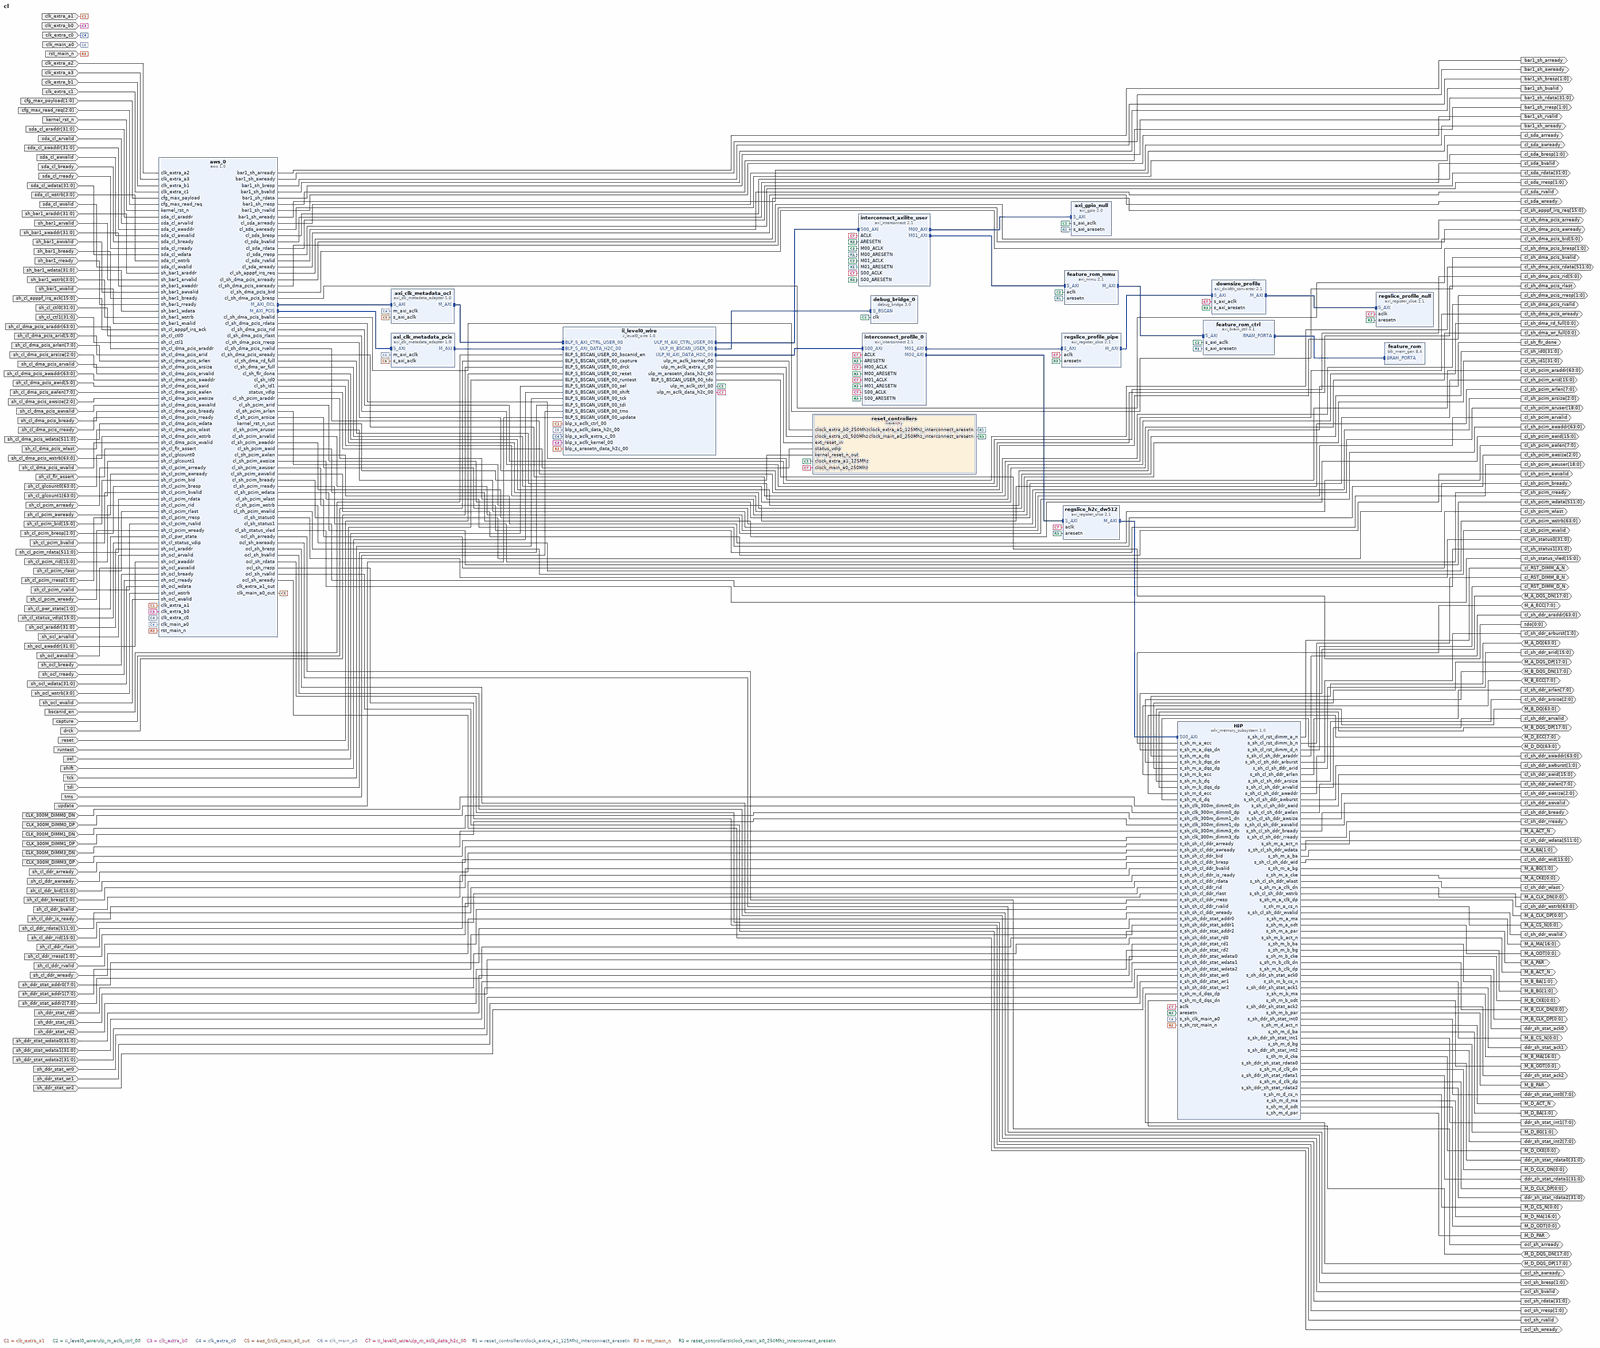
[diagram p0: block diagram of the top level, whole]
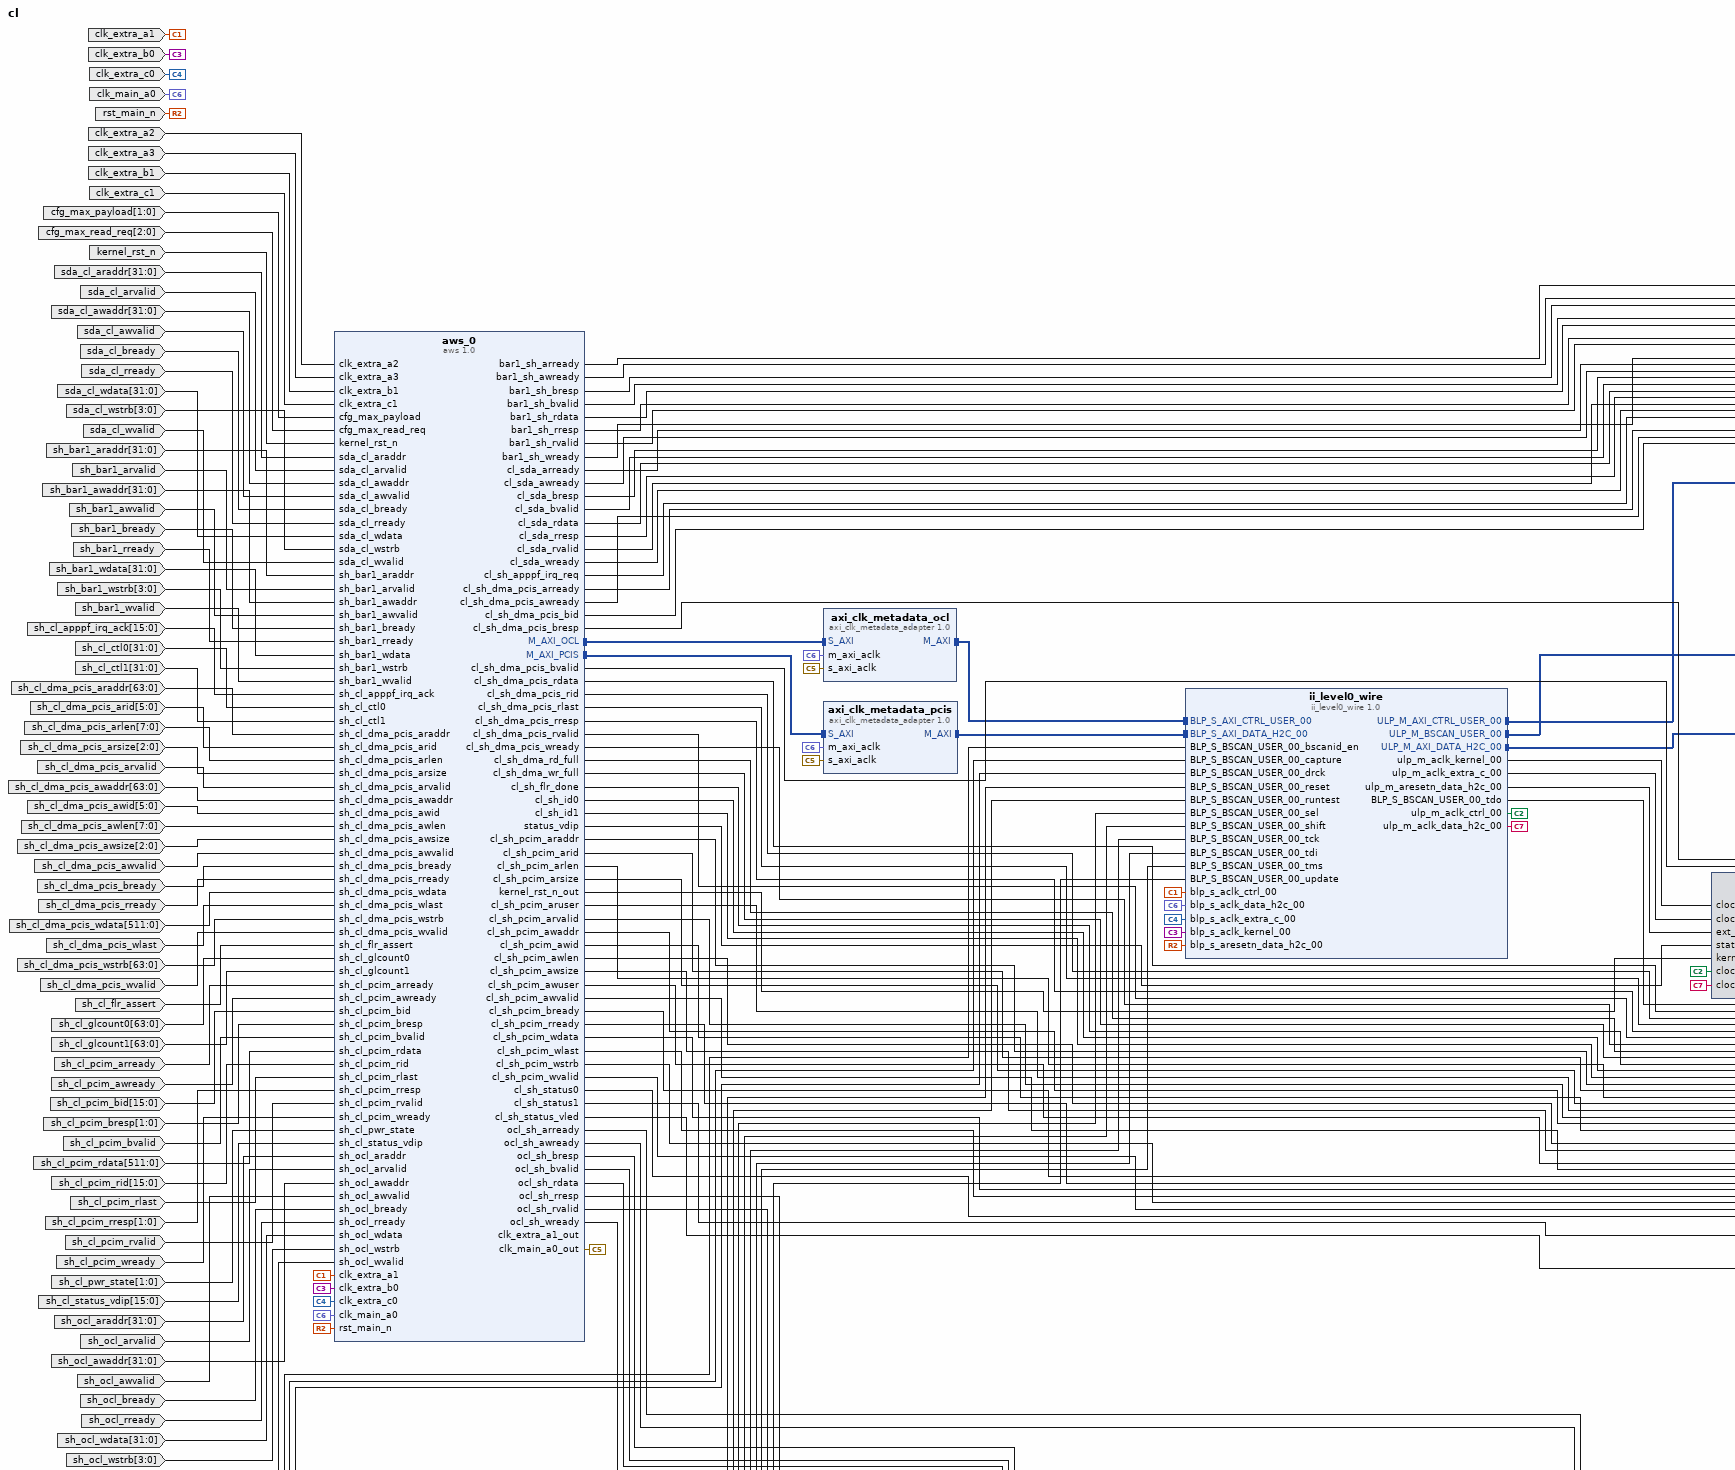
[diagram p1: block diagram of the top level, upper left part]
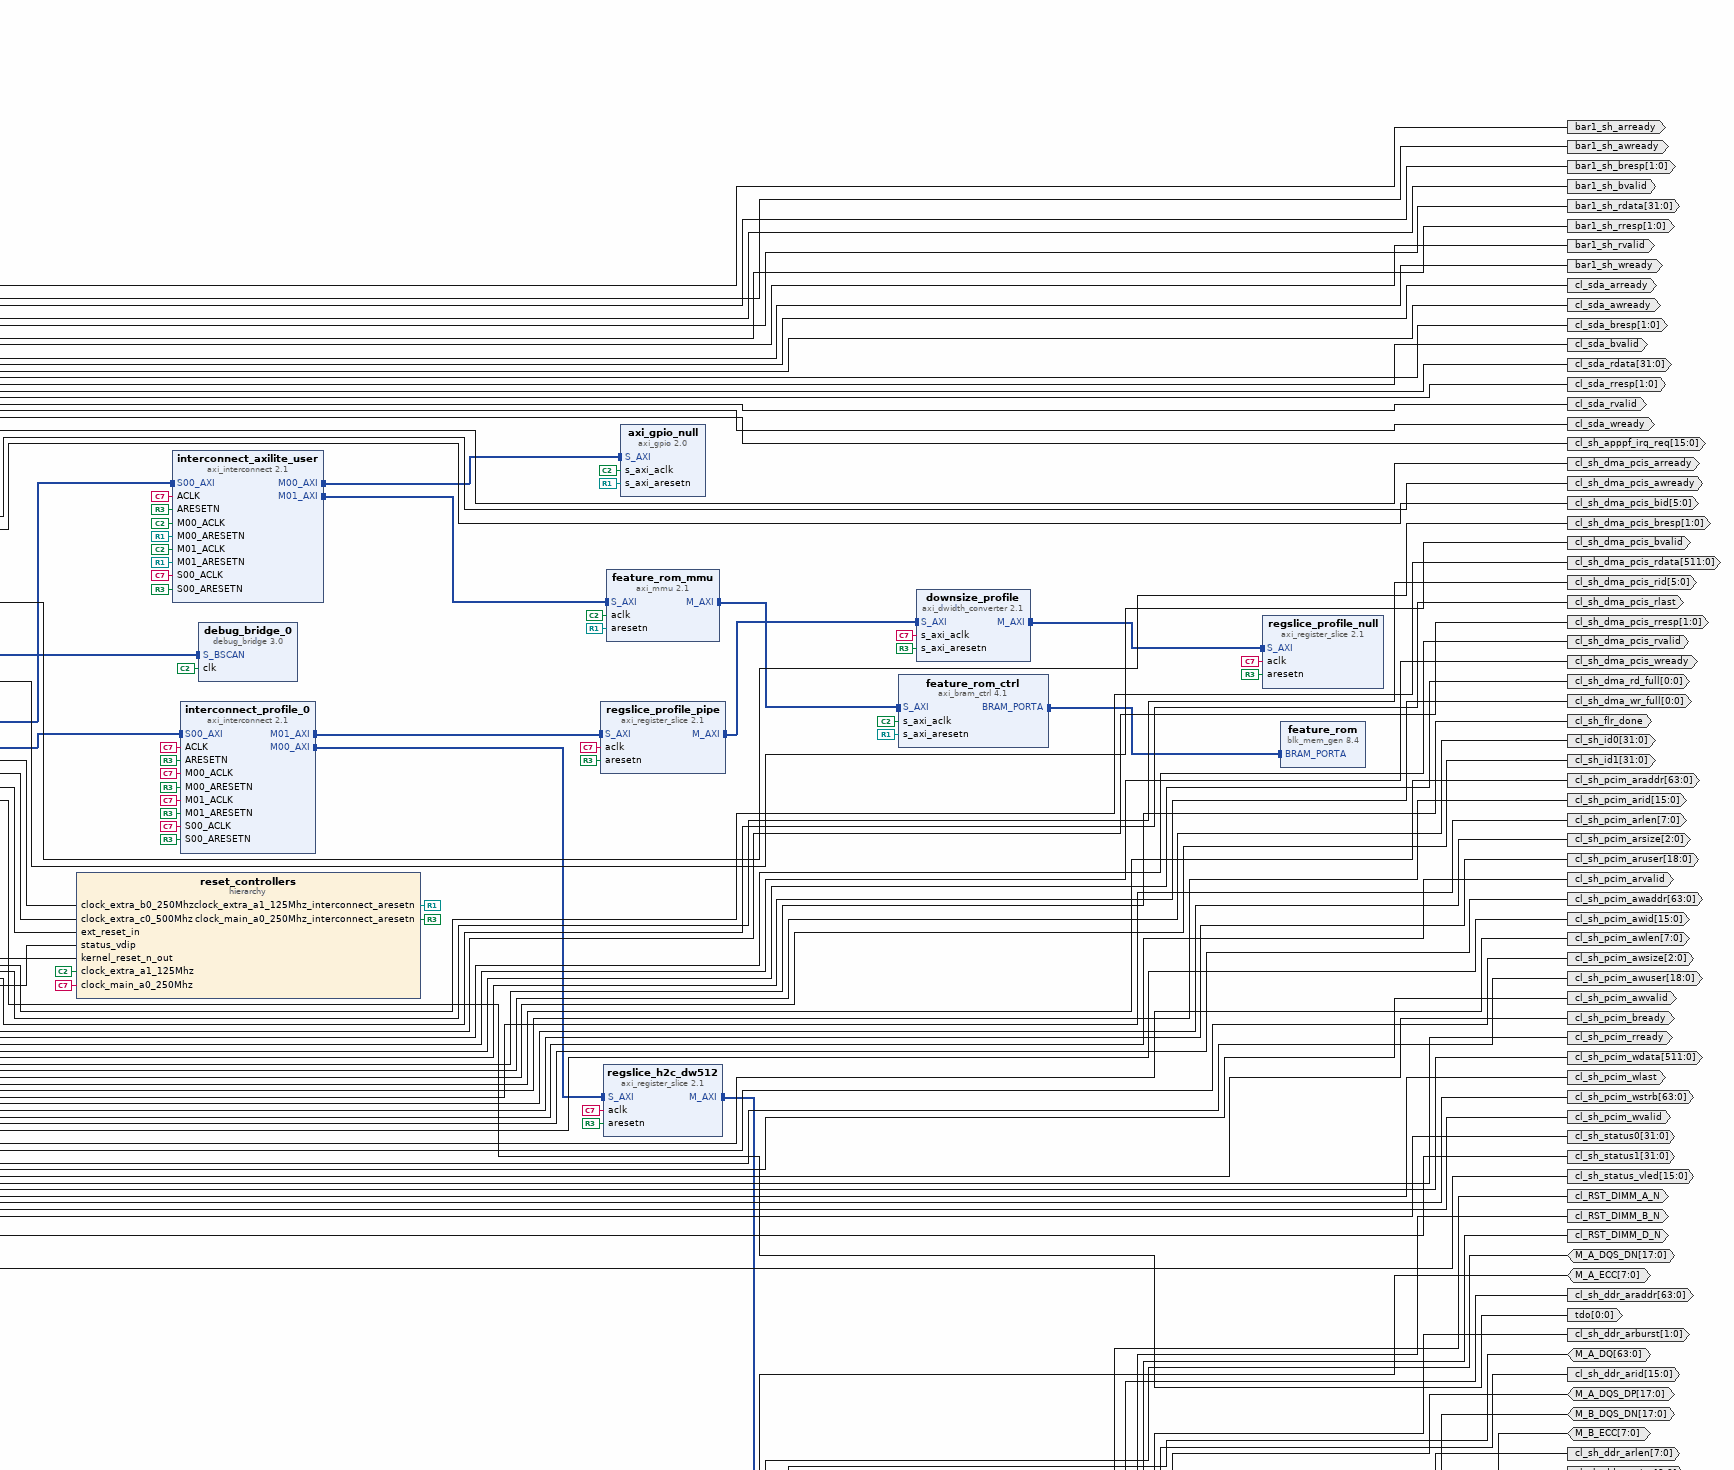
[diagram p2: block diagram of the top level, upper right part]
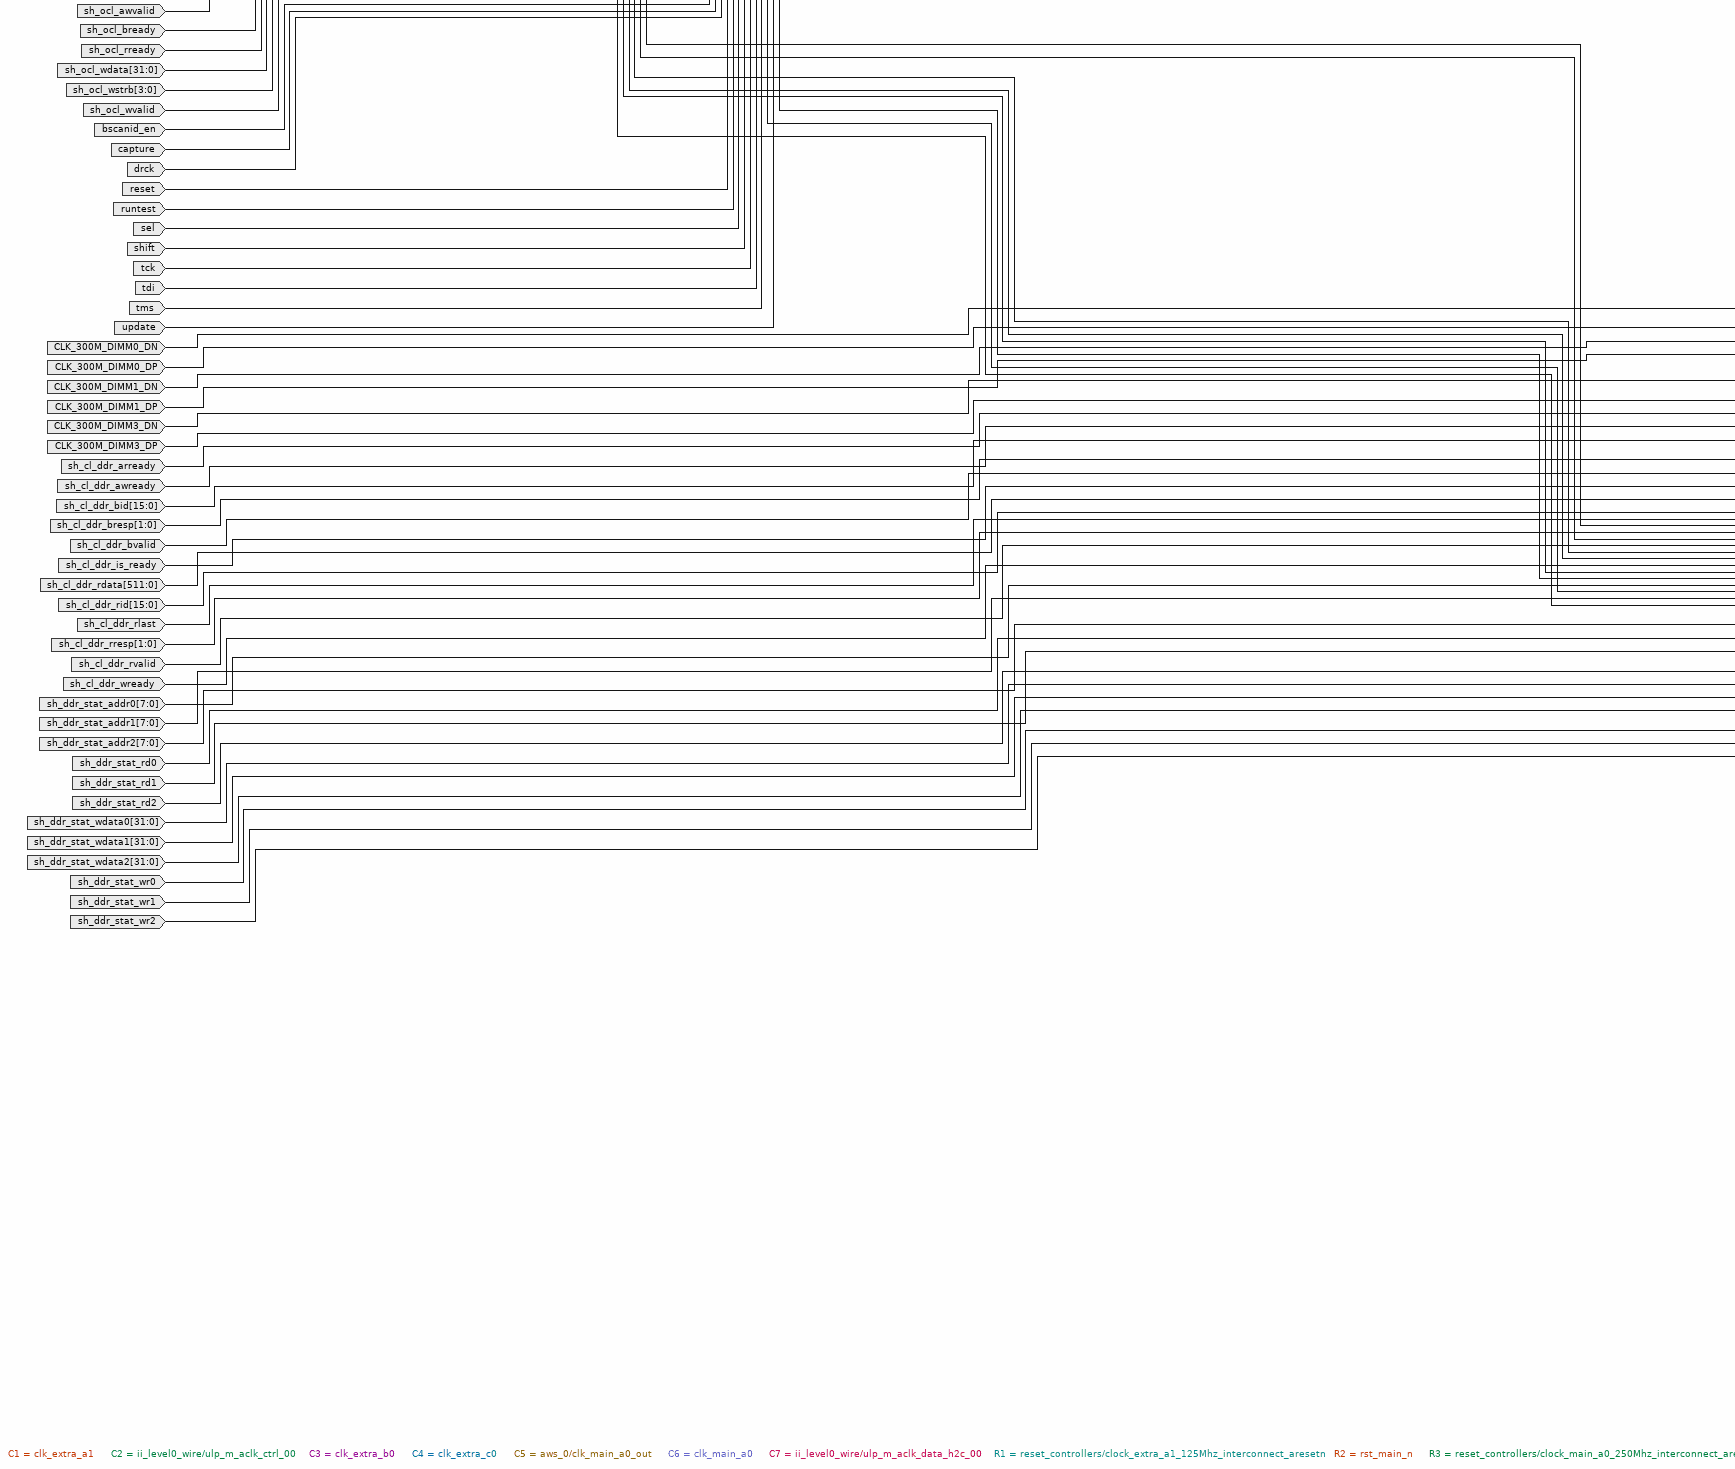
[diagram p3: block diagram of the top level, lower left part]
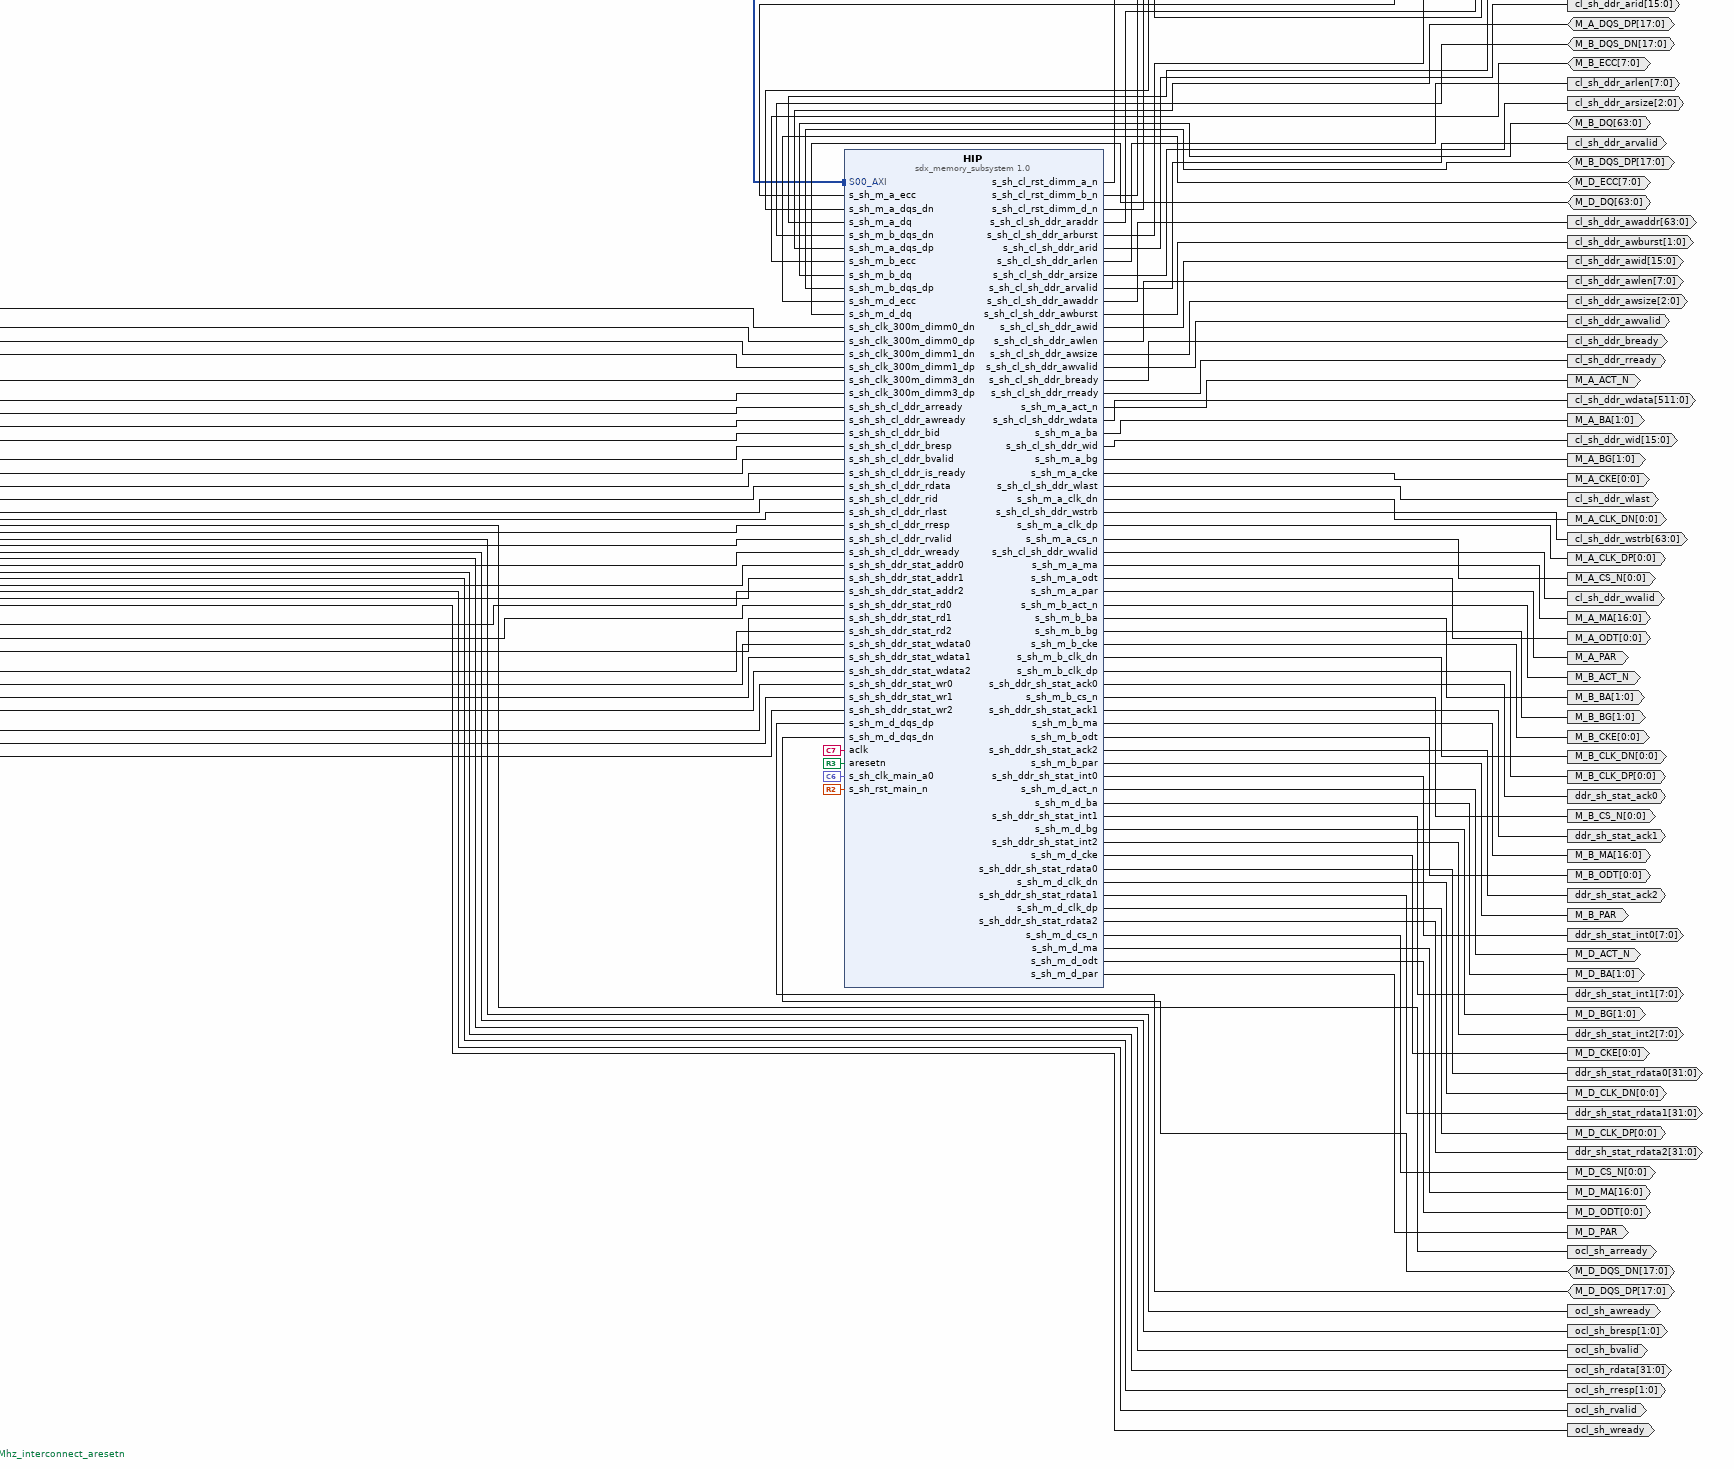
[diagram p4: block diagram of the top level, lower right part]
# Vivado block design cl, xcvu9p-flgb2104-2-i, Vivado 2019.2
create_bd_design cl

create_bd_port -dir I CLK_300M_DIMM0_DN
create_bd_port -dir I CLK_300M_DIMM0_DP
create_bd_port -dir I CLK_300M_DIMM1_DN
create_bd_port -dir I CLK_300M_DIMM1_DP
create_bd_port -dir I CLK_300M_DIMM3_DN
create_bd_port -dir I CLK_300M_DIMM3_DP
create_bd_port -dir O M_A_ACT_N
create_bd_port -dir O -from 1 -to 0 M_A_BA
create_bd_port -dir O -from 1 -to 0 M_A_BG
create_bd_port -dir O -from 0 -to 0 M_A_CKE
create_bd_port -dir O -from 0 -to 0 M_A_CLK_DN
create_bd_port -dir O -from 0 -to 0 M_A_CLK_DP
create_bd_port -dir O -from 0 -to 0 M_A_CS_N
create_bd_port -dir IO -from 63 -to 0 M_A_DQ
create_bd_port -dir IO -from 17 -to 0 M_A_DQS_DN
create_bd_port -dir IO -from 17 -to 0 M_A_DQS_DP
create_bd_port -dir IO -from 7 -to 0 M_A_ECC
create_bd_port -dir O -from 16 -to 0 M_A_MA
create_bd_port -dir O -from 0 -to 0 M_A_ODT
create_bd_port -dir O M_A_PAR
create_bd_port -dir O M_B_ACT_N
create_bd_port -dir O -from 1 -to 0 M_B_BA
create_bd_port -dir O -from 1 -to 0 M_B_BG
create_bd_port -dir O -from 0 -to 0 M_B_CKE
create_bd_port -dir O -from 0 -to 0 M_B_CLK_DN
create_bd_port -dir O -from 0 -to 0 M_B_CLK_DP
create_bd_port -dir O -from 0 -to 0 M_B_CS_N
create_bd_port -dir IO -from 63 -to 0 M_B_DQ
create_bd_port -dir IO -from 17 -to 0 M_B_DQS_DN
create_bd_port -dir IO -from 17 -to 0 M_B_DQS_DP
create_bd_port -dir IO -from 7 -to 0 M_B_ECC
create_bd_port -dir O -from 16 -to 0 M_B_MA
create_bd_port -dir O -from 0 -to 0 M_B_ODT
create_bd_port -dir O M_B_PAR
create_bd_port -dir O M_D_ACT_N
create_bd_port -dir O -from 1 -to 0 M_D_BA
create_bd_port -dir O -from 1 -to 0 M_D_BG
create_bd_port -dir O -from 0 -to 0 M_D_CKE
create_bd_port -dir O -from 0 -to 0 M_D_CLK_DN
create_bd_port -dir O -from 0 -to 0 M_D_CLK_DP
create_bd_port -dir O -from 0 -to 0 M_D_CS_N
create_bd_port -dir IO -from 63 -to 0 M_D_DQ
create_bd_port -dir IO -from 17 -to 0 M_D_DQS_DN
create_bd_port -dir IO -from 17 -to 0 M_D_DQS_DP
create_bd_port -dir IO -from 7 -to 0 M_D_ECC
create_bd_port -dir O -from 16 -to 0 M_D_MA
create_bd_port -dir O -from 0 -to 0 M_D_ODT
create_bd_port -dir O M_D_PAR
create_bd_port -dir O bar1_sh_arready
create_bd_port -dir O bar1_sh_awready
create_bd_port -dir O -from 1 -to 0 bar1_sh_bresp
create_bd_port -dir O bar1_sh_bvalid
create_bd_port -dir O -from 31 -to 0 bar1_sh_rdata
create_bd_port -dir O -from 1 -to 0 bar1_sh_rresp
create_bd_port -dir O bar1_sh_rvalid
create_bd_port -dir O bar1_sh_wready
create_bd_port -dir I bscanid_en
create_bd_port -dir I capture
create_bd_port -dir I -from 1 -to 0 cfg_max_payload
create_bd_port -dir I -from 2 -to 0 cfg_max_read_req
create_bd_port -dir O cl_RST_DIMM_A_N
create_bd_port -dir O cl_RST_DIMM_B_N
create_bd_port -dir O cl_RST_DIMM_D_N
create_bd_port -dir O cl_sda_arready
create_bd_port -dir O cl_sda_awready
create_bd_port -dir O -from 1 -to 0 cl_sda_bresp
create_bd_port -dir O cl_sda_bvalid
create_bd_port -dir O -from 31 -to 0 cl_sda_rdata
create_bd_port -dir O -from 1 -to 0 cl_sda_rresp
create_bd_port -dir O cl_sda_rvalid
create_bd_port -dir O cl_sda_wready
create_bd_port -dir O -from 15 -to 0 cl_sh_apppf_irq_req
create_bd_port -dir O -from 63 -to 0 cl_sh_ddr_araddr
create_bd_port -dir O -from 1 -to 0 cl_sh_ddr_arburst
create_bd_port -dir O -from 15 -to 0 cl_sh_ddr_arid
create_bd_port -dir O -from 7 -to 0 cl_sh_ddr_arlen
create_bd_port -dir O -from 2 -to 0 cl_sh_ddr_arsize
create_bd_port -dir O cl_sh_ddr_arvalid
create_bd_port -dir O -from 63 -to 0 cl_sh_ddr_awaddr
create_bd_port -dir O -from 1 -to 0 cl_sh_ddr_awburst
create_bd_port -dir O -from 15 -to 0 cl_sh_ddr_awid
create_bd_port -dir O -from 7 -to 0 cl_sh_ddr_awlen
create_bd_port -dir O -from 2 -to 0 cl_sh_ddr_awsize
create_bd_port -dir O cl_sh_ddr_awvalid
create_bd_port -dir O cl_sh_ddr_bready
create_bd_port -dir O cl_sh_ddr_rready
create_bd_port -dir O -from 511 -to 0 cl_sh_ddr_wdata
create_bd_port -dir O -from 15 -to 0 cl_sh_ddr_wid
create_bd_port -dir O cl_sh_ddr_wlast
create_bd_port -dir O -from 63 -to 0 cl_sh_ddr_wstrb
create_bd_port -dir O cl_sh_ddr_wvalid
create_bd_port -dir O cl_sh_dma_pcis_arready
create_bd_port -dir O cl_sh_dma_pcis_awready
create_bd_port -dir O -from 5 -to 0 cl_sh_dma_pcis_bid
create_bd_port -dir O -from 1 -to 0 cl_sh_dma_pcis_bresp
create_bd_port -dir O cl_sh_dma_pcis_bvalid
create_bd_port -dir O -from 511 -to 0 cl_sh_dma_pcis_rdata
create_bd_port -dir O -from 5 -to 0 cl_sh_dma_pcis_rid
create_bd_port -dir O cl_sh_dma_pcis_rlast
create_bd_port -dir O -from 1 -to 0 cl_sh_dma_pcis_rresp
create_bd_port -dir O cl_sh_dma_pcis_rvalid
create_bd_port -dir O cl_sh_dma_pcis_wready
create_bd_port -dir O -from 0 -to 0 cl_sh_dma_rd_full
create_bd_port -dir O -from 0 -to 0 cl_sh_dma_wr_full
create_bd_port -dir O cl_sh_flr_done
create_bd_port -dir O -from 31 -to 0 cl_sh_id0
create_bd_port -dir O -from 31 -to 0 cl_sh_id1
create_bd_port -dir O -from 63 -to 0 cl_sh_pcim_araddr
create_bd_port -dir O -from 15 -to 0 cl_sh_pcim_arid
create_bd_port -dir O -from 7 -to 0 cl_sh_pcim_arlen
create_bd_port -dir O -from 2 -to 0 cl_sh_pcim_arsize
create_bd_port -dir O -from 18 -to 0 cl_sh_pcim_aruser
create_bd_port -dir O cl_sh_pcim_arvalid
create_bd_port -dir O -from 63 -to 0 cl_sh_pcim_awaddr
create_bd_port -dir O -from 15 -to 0 cl_sh_pcim_awid
create_bd_port -dir O -from 7 -to 0 cl_sh_pcim_awlen
create_bd_port -dir O -from 2 -to 0 cl_sh_pcim_awsize
create_bd_port -dir O -from 18 -to 0 cl_sh_pcim_awuser
create_bd_port -dir O cl_sh_pcim_awvalid
create_bd_port -dir O cl_sh_pcim_bready
create_bd_port -dir O cl_sh_pcim_rready
create_bd_port -dir O -from 511 -to 0 cl_sh_pcim_wdata
create_bd_port -dir O cl_sh_pcim_wlast
create_bd_port -dir O -from 63 -to 0 cl_sh_pcim_wstrb
create_bd_port -dir O cl_sh_pcim_wvalid
create_bd_port -dir O -from 31 -to 0 cl_sh_status0
create_bd_port -dir O -from 31 -to 0 cl_sh_status1
create_bd_port -dir O -from 15 -to 0 cl_sh_status_vled
create_bd_port -dir I -type clk clk_extra_a1
set_property -dict {CONFIG.CLK_DOMAIN cd_ctrl_00 CONFIG.FREQ_HZ 125000000} [get_bd_ports clk_extra_a1]
create_bd_port -dir I clk_extra_a2
create_bd_port -dir I clk_extra_a3
create_bd_port -dir I -type clk clk_extra_b0
set_property -dict {CONFIG.CLK_DOMAIN cd_extra_b_00 CONFIG.FREQ_HZ 250000000} [get_bd_ports clk_extra_b0]
create_bd_port -dir I clk_extra_b1
create_bd_port -dir I -type clk clk_extra_c0
set_property -dict {CONFIG.CLK_DOMAIN cd_extra_c_00 CONFIG.FREQ_HZ 500000000} [get_bd_ports clk_extra_c0]
create_bd_port -dir I clk_extra_c1
create_bd_port -dir I -type clk clk_main_a0
set_property -dict {CONFIG.CLK_DOMAIN cd_data_h2c_00 CONFIG.FREQ_HZ 250000000} [get_bd_ports clk_main_a0]
create_bd_port -dir O ddr_sh_stat_ack0
create_bd_port -dir O ddr_sh_stat_ack1
create_bd_port -dir O ddr_sh_stat_ack2
create_bd_port -dir O -from 7 -to 0 ddr_sh_stat_int0
create_bd_port -dir O -from 7 -to 0 ddr_sh_stat_int1
create_bd_port -dir O -from 7 -to 0 ddr_sh_stat_int2
create_bd_port -dir O -from 31 -to 0 ddr_sh_stat_rdata0
create_bd_port -dir O -from 31 -to 0 ddr_sh_stat_rdata1
create_bd_port -dir O -from 31 -to 0 ddr_sh_stat_rdata2
create_bd_port -dir I -type clk drck
create_bd_port -dir I kernel_rst_n
create_bd_port -dir O ocl_sh_arready
create_bd_port -dir O ocl_sh_awready
create_bd_port -dir O -from 1 -to 0 ocl_sh_bresp
create_bd_port -dir O ocl_sh_bvalid
create_bd_port -dir O -from 31 -to 0 ocl_sh_rdata
create_bd_port -dir O -from 1 -to 0 ocl_sh_rresp
create_bd_port -dir O ocl_sh_rvalid
create_bd_port -dir O ocl_sh_wready
create_bd_port -dir I -type rst reset
create_bd_port -dir I rst_main_n
create_bd_port -dir I runtest
create_bd_port -dir I -from 31 -to 0 sda_cl_araddr
create_bd_port -dir I sda_cl_arvalid
create_bd_port -dir I -from 31 -to 0 sda_cl_awaddr
create_bd_port -dir I sda_cl_awvalid
create_bd_port -dir I sda_cl_bready
create_bd_port -dir I sda_cl_rready
create_bd_port -dir I -from 31 -to 0 sda_cl_wdata
create_bd_port -dir I -from 3 -to 0 sda_cl_wstrb
create_bd_port -dir I sda_cl_wvalid
create_bd_port -dir I sel
create_bd_port -dir I -from 31 -to 0 sh_bar1_araddr
create_bd_port -dir I sh_bar1_arvalid
create_bd_port -dir I -from 31 -to 0 sh_bar1_awaddr
create_bd_port -dir I sh_bar1_awvalid
create_bd_port -dir I sh_bar1_bready
create_bd_port -dir I sh_bar1_rready
create_bd_port -dir I -from 31 -to 0 sh_bar1_wdata
create_bd_port -dir I -from 3 -to 0 sh_bar1_wstrb
create_bd_port -dir I sh_bar1_wvalid
create_bd_port -dir I -from 15 -to 0 sh_cl_apppf_irq_ack
create_bd_port -dir I -from 31 -to 0 sh_cl_ctl0
create_bd_port -dir I -from 31 -to 0 sh_cl_ctl1
create_bd_port -dir I sh_cl_ddr_arready
create_bd_port -dir I sh_cl_ddr_awready
create_bd_port -dir I -from 15 -to 0 sh_cl_ddr_bid
create_bd_port -dir I -from 1 -to 0 sh_cl_ddr_bresp
create_bd_port -dir I sh_cl_ddr_bvalid
create_bd_port -dir I sh_cl_ddr_is_ready
create_bd_port -dir I -from 511 -to 0 sh_cl_ddr_rdata
create_bd_port -dir I -from 15 -to 0 sh_cl_ddr_rid
create_bd_port -dir I sh_cl_ddr_rlast
create_bd_port -dir I -from 1 -to 0 sh_cl_ddr_rresp
create_bd_port -dir I sh_cl_ddr_rvalid
create_bd_port -dir I sh_cl_ddr_wready
create_bd_port -dir I -from 63 -to 0 sh_cl_dma_pcis_araddr
create_bd_port -dir I -from 5 -to 0 sh_cl_dma_pcis_arid
create_bd_port -dir I -from 7 -to 0 sh_cl_dma_pcis_arlen
create_bd_port -dir I -from 2 -to 0 sh_cl_dma_pcis_arsize
create_bd_port -dir I sh_cl_dma_pcis_arvalid
create_bd_port -dir I -from 63 -to 0 sh_cl_dma_pcis_awaddr
create_bd_port -dir I -from 5 -to 0 sh_cl_dma_pcis_awid
create_bd_port -dir I -from 7 -to 0 sh_cl_dma_pcis_awlen
create_bd_port -dir I -from 2 -to 0 sh_cl_dma_pcis_awsize
create_bd_port -dir I sh_cl_dma_pcis_awvalid
create_bd_port -dir I sh_cl_dma_pcis_bready
create_bd_port -dir I sh_cl_dma_pcis_rready
create_bd_port -dir I -from 511 -to 0 sh_cl_dma_pcis_wdata
create_bd_port -dir I sh_cl_dma_pcis_wlast
create_bd_port -dir I -from 63 -to 0 sh_cl_dma_pcis_wstrb
create_bd_port -dir I sh_cl_dma_pcis_wvalid
create_bd_port -dir I sh_cl_flr_assert
create_bd_port -dir I -from 63 -to 0 sh_cl_glcount0
create_bd_port -dir I -from 63 -to 0 sh_cl_glcount1
create_bd_port -dir I sh_cl_pcim_arready
create_bd_port -dir I sh_cl_pcim_awready
create_bd_port -dir I -from 15 -to 0 sh_cl_pcim_bid
create_bd_port -dir I -from 1 -to 0 sh_cl_pcim_bresp
create_bd_port -dir I sh_cl_pcim_bvalid
create_bd_port -dir I -from 511 -to 0 sh_cl_pcim_rdata
create_bd_port -dir I -from 15 -to 0 sh_cl_pcim_rid
create_bd_port -dir I sh_cl_pcim_rlast
create_bd_port -dir I -from 1 -to 0 sh_cl_pcim_rresp
create_bd_port -dir I sh_cl_pcim_rvalid
create_bd_port -dir I sh_cl_pcim_wready
create_bd_port -dir I -from 1 -to 0 sh_cl_pwr_state
create_bd_port -dir I -from 15 -to 0 sh_cl_status_vdip
create_bd_port -dir I -from 7 -to 0 sh_ddr_stat_addr0
create_bd_port -dir I -from 7 -to 0 sh_ddr_stat_addr1
create_bd_port -dir I -from 7 -to 0 sh_ddr_stat_addr2
create_bd_port -dir I sh_ddr_stat_rd0
create_bd_port -dir I sh_ddr_stat_rd1
create_bd_port -dir I sh_ddr_stat_rd2
create_bd_port -dir I -from 31 -to 0 sh_ddr_stat_wdata0
create_bd_port -dir I -from 31 -to 0 sh_ddr_stat_wdata1
create_bd_port -dir I -from 31 -to 0 sh_ddr_stat_wdata2
create_bd_port -dir I sh_ddr_stat_wr0
create_bd_port -dir I sh_ddr_stat_wr1
create_bd_port -dir I sh_ddr_stat_wr2
create_bd_port -dir I -from 31 -to 0 sh_ocl_araddr
create_bd_port -dir I sh_ocl_arvalid
create_bd_port -dir I -from 31 -to 0 sh_ocl_awaddr
create_bd_port -dir I sh_ocl_awvalid
create_bd_port -dir I sh_ocl_bready
create_bd_port -dir I sh_ocl_rready
create_bd_port -dir I -from 31 -to 0 sh_ocl_wdata
create_bd_port -dir I -from 3 -to 0 sh_ocl_wstrb
create_bd_port -dir I sh_ocl_wvalid
create_bd_port -dir I shift
create_bd_port -dir I -type clk tck
create_bd_port -dir I tdi
create_bd_port -dir O -from 0 -to 0 tdo
create_bd_port -dir I tms
create_bd_port -dir I -type clk update

create_bd_cell -type ip -vlnv xilinx.com:ip:ii_level0_wire:1.0 ii_level0_wire
create_bd_cell -type ip -vlnv xilinx.com:ip:aws:1.0 aws_0
set_property -dict [list \
  CONFIG.AUX_PRESENT 1 \
  CONFIG.CLOCK_A_RECIPE 1 \
  CONFIG.CLOCK_C_RECIPE 0 \
  CONFIG.DEVICE_ID 0xF010 \
  CONFIG.MODE 2 \
  CONFIG.NUM_A_CLOCKS 2 \
  CONFIG.NUM_B_CLOCKS 1 \
  CONFIG.NUM_C_CLOCKS 1 \
  CONFIG.OCL_PRESENT 1 \
  CONFIG.PCIS_PRESENT 1 \
  CONFIG.SLR_ASSIGNMENTS SLR0 \
] [get_bd_cells aws_0]
create_bd_cell -type ip -vlnv xilinx.com:ip:axi_gpio:2.0 axi_gpio_null
create_bd_cell -type ip -vlnv xilinx.com:ip:debug_bridge:3.0 debug_bridge_0
set_property -dict {CONFIG.C_DEBUG_MODE 1 CONFIG.C_DESIGN_TYPE 1} [get_bd_cells debug_bridge_0]
create_bd_cell -type ip -vlnv xilinx.com:ip:blk_mem_gen:8.4 feature_rom
create_bd_cell -type ip -vlnv xilinx.com:ip:axi_bram_ctrl:4.1 feature_rom_ctrl
set_property -dict {CONFIG.SINGLE_PORT_BRAM 1} [get_bd_cells feature_rom_ctrl]
create_bd_cell -type ip -vlnv xilinx.com:ip:axi_mmu:2.1 feature_rom_mmu
create_bd_cell -type ip -vlnv xilinx.com:ip:axi_interconnect:2.1 interconnect_axilite_user
set_property -dict [list \
  CONFIG.NUM_MI 2 \
  CONFIG.S00_HAS_REGSLICE 4 \
  CONFIG.SYNCHRONIZATION_STAGES 2 \
] [get_bd_cells interconnect_axilite_user]
create_bd_cell -type ip -vlnv xilinx.com:ip:axi_clk_metadata_adapter:1.0 axi_clk_metadata_pcis
create_bd_cell -type ip -vlnv xilinx.com:ip:axi_clk_metadata_adapter:1.0 axi_clk_metadata_ocl
create_bd_cell -type ip -vlnv xilinx.com:ip:axi_interconnect:2.1 interconnect_profile_0
set_property -dict {CONFIG.NUM_MI 2 CONFIG.NUM_SI 1} [get_bd_cells interconnect_profile_0]
create_bd_cell -type ip -vlnv xilinx.com:ip:axi_register_slice:2.1 regslice_profile_pipe
set_property -dict [list \
  CONFIG.ADDR_WIDTH 40 \
  CONFIG.DATA_WIDTH 512 \
  CONFIG.PROTOCOL AXI4 \
  CONFIG.READ_WRITE_MODE READ_WRITE \
  CONFIG.REG_AR 7 \
  CONFIG.REG_AW 7 \
  CONFIG.REG_B 7 \
  CONFIG.REG_R 7 \
  CONFIG.REG_W 7 \
] [get_bd_cells regslice_profile_pipe]
create_bd_cell -type ip -vlnv xilinx.com:ip:axi_dwidth_converter:2.1 downsize_profile
create_bd_cell -type ip -vlnv xilinx.com:ip:axi_register_slice:2.1 regslice_profile_null
set_property -dict [list \
  CONFIG.ADDR_WIDTH 40 \
  CONFIG.DATA_WIDTH 64 \
  CONFIG.PROTOCOL AXI4 \
  CONFIG.READ_WRITE_MODE READ_WRITE \
  CONFIG.REG_AR 7 \
  CONFIG.REG_AW 7 \
  CONFIG.REG_B 7 \
  CONFIG.REG_R 7 \
  CONFIG.REG_W 7 \
] [get_bd_cells regslice_profile_null]
create_bd_cell -type ip -vlnv xilinx.com:ip:sdx_memory_subsystem:1.0 HIP
set_property -dict [list \
  CONFIG.ADVANCED_PROPERTIES {plram_specifications {{ SIZE 128K AXI_DATA_WIDTH 512 SLR_ASSIGNMENT SLR2 } { SIZE 128K AXI_DATA_WIDTH 512 SLR_ASSIGNMENT SLR1 } { SIZE 128K AXI_DATA_WIDTH 512 SLR_ASSIGNMENT SLR0 }}} \
] [get_bd_cells HIP]
create_bd_cell -type hier reset_controllers
create_bd_cell -type ip -vlnv xilinx.com:ip:axi_register_slice:2.1 regslice_h2c_dw512
set_property -dict [list \
  CONFIG.DATA_WIDTH 512 \
  CONFIG.HAS_BURST 0 \
  CONFIG.NUM_READ_OUTSTANDING 16 \
  CONFIG.NUM_READ_THREADS 4 \
  CONFIG.NUM_WRITE_OUTSTANDING 16 \
  CONFIG.NUM_WRITE_THREADS 4 \
  CONFIG.REG_AR 0 \
  CONFIG.REG_AW 0 \
  CONFIG.REG_B 0 \
  CONFIG.REG_R 0 \
  CONFIG.REG_W 0 \
  CONFIG.SLR_ASSIGNMENTS SLR0 \
  CONFIG.SUPPORTS_NARROW_BURST 0 \
] [get_bd_cells regslice_h2c_dw512]

# ---- hierarchy /reset_controllers ----
current_bd_instance /reset_controllers
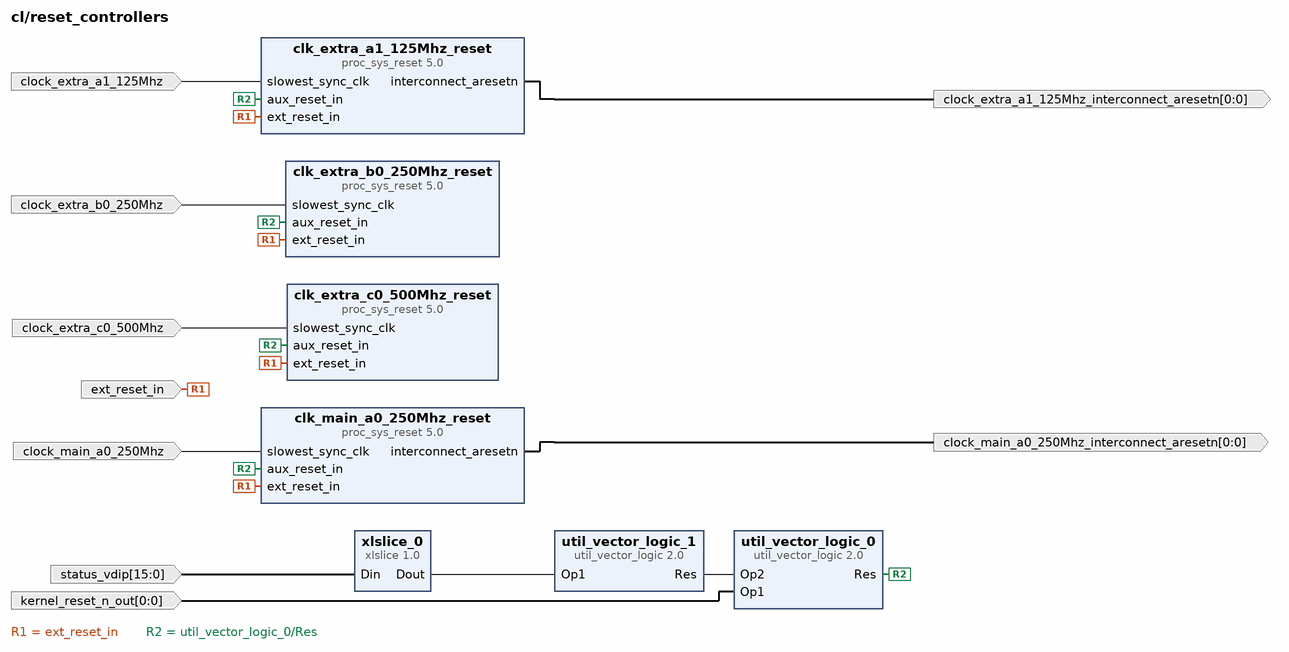
[diagram p5: block diagram inside /reset_controllers]
create_bd_pin -dir I -type clk clock_extra_a1_125Mhz
create_bd_pin -dir O -from 0 -to 0 -type rst clock_extra_a1_125Mhz_interconnect_aresetn
create_bd_pin -dir I -type clk clock_extra_b0_250Mhz
create_bd_pin -dir I -type clk clock_extra_c0_500Mhz
create_bd_pin -dir I -type clk clock_main_a0_250Mhz
create_bd_pin -dir O -from 0 -to 0 -type rst clock_main_a0_250Mhz_interconnect_aresetn
create_bd_pin -dir I -type rst ext_reset_in
create_bd_pin -dir I -from 0 -to 0 kernel_reset_n_out
create_bd_pin -dir I -from 15 -to 0 status_vdip

create_bd_cell -type ip -vlnv xilinx.com:ip:proc_sys_reset:5.0 clk_extra_a1_125Mhz_reset
create_bd_cell -type ip -vlnv xilinx.com:ip:proc_sys_reset:5.0 clk_extra_b0_250Mhz_reset
create_bd_cell -type ip -vlnv xilinx.com:ip:proc_sys_reset:5.0 clk_extra_c0_500Mhz_reset
create_bd_cell -type ip -vlnv xilinx.com:ip:proc_sys_reset:5.0 clk_main_a0_250Mhz_reset
create_bd_cell -type ip -vlnv xilinx.com:ip:util_vector_logic:2.0 util_vector_logic_0
set_property -dict {CONFIG.C_OPERATION or CONFIG.C_SIZE 1} [get_bd_cells util_vector_logic_0]
create_bd_cell -type ip -vlnv xilinx.com:ip:util_vector_logic:2.0 util_vector_logic_1
set_property -dict {CONFIG.C_OPERATION not CONFIG.C_SIZE 1} [get_bd_cells util_vector_logic_1]
create_bd_cell -type ip -vlnv xilinx.com:ip:xlslice:1.0 xlslice_0
set_property -dict {CONFIG.DIN_FROM 15 CONFIG.DIN_TO 15 CONFIG.DIN_WIDTH 16 CONFIG.DOUT_WIDTH 1} [get_bd_cells xlslice_0]

# ---- connections ----

current_bd_instance /reset_controllers
connect_bd_net -net aws_0_clk_extra_a1_out [get_bd_pins clock_extra_a1_125Mhz] [get_bd_pins clk_extra_a1_125Mhz_reset/slowest_sync_clk]
connect_bd_net -net aws_0_clk_extra_b0_out [get_bd_pins clock_extra_b0_250Mhz] [get_bd_pins clk_extra_b0_250Mhz_reset/slowest_sync_clk]
connect_bd_net -net aws_0_clk_extra_c0_out [get_bd_pins clock_extra_c0_500Mhz] [get_bd_pins clk_extra_c0_500Mhz_reset/slowest_sync_clk]
connect_bd_net -net aws_0_clk_main_a0_out [get_bd_pins clock_main_a0_250Mhz] [get_bd_pins clk_main_a0_250Mhz_reset/slowest_sync_clk]
connect_bd_net -net aws_0_kernel_rst_n_out [get_bd_pins kernel_reset_n_out] [get_bd_pins util_vector_logic_0/Op1]
connect_bd_net -net aws_0_rst_main_n_out [get_bd_pins ext_reset_in] \
  [get_bd_pins clk_extra_a1_125Mhz_reset/ext_reset_in] [get_bd_pins clk_extra_b0_250Mhz_reset/ext_reset_in] \
  [get_bd_pins clk_extra_c0_500Mhz_reset/ext_reset_in] [get_bd_pins clk_main_a0_250Mhz_reset/ext_reset_in]
connect_bd_net -net aws_0_status_vdip [get_bd_pins status_vdip] [get_bd_pins xlslice_0/Din]
connect_bd_net [get_bd_pins clk_extra_a1_125Mhz_reset/interconnect_aresetn] [get_bd_pins clock_extra_a1_125Mhz_interconnect_aresetn]
connect_bd_net [get_bd_pins clk_main_a0_250Mhz_reset/interconnect_aresetn] [get_bd_pins clock_main_a0_250Mhz_interconnect_aresetn]
connect_bd_net [get_bd_pins util_vector_logic_0/Res] \
  [get_bd_pins clk_extra_a1_125Mhz_reset/aux_reset_in] [get_bd_pins clk_extra_b0_250Mhz_reset/aux_reset_in] \
  [get_bd_pins clk_extra_c0_500Mhz_reset/aux_reset_in] [get_bd_pins clk_main_a0_250Mhz_reset/aux_reset_in]
connect_bd_net [get_bd_pins util_vector_logic_1/Res] [get_bd_pins util_vector_logic_0/Op2]
connect_bd_net [get_bd_pins xlslice_0/Dout] [get_bd_pins util_vector_logic_1/Op1]

current_bd_instance /
connect_bd_intf_net [get_bd_intf_pins regslice_h2c_dw512/M_AXI] [get_bd_intf_pins HIP/S00_AXI]
connect_bd_intf_net [get_bd_intf_pins interconnect_profile_0/M00_AXI] [get_bd_intf_pins regslice_h2c_dw512/S_AXI]
connect_bd_intf_net [get_bd_intf_pins downsize_profile/M_AXI] [get_bd_intf_pins regslice_profile_null/S_AXI]
connect_bd_intf_net [get_bd_intf_pins regslice_profile_pipe/M_AXI] [get_bd_intf_pins downsize_profile/S_AXI]
connect_bd_intf_net -intf_net S_BSCAN_0_ii [get_bd_intf_pins ii_level0_wire/ULP_M_BSCAN_USER_00] [get_bd_intf_pins debug_bridge_0/S_BSCAN]
connect_bd_intf_net [get_bd_intf_pins interconnect_profile_0/M01_AXI] [get_bd_intf_pins regslice_profile_pipe/S_AXI]
connect_bd_intf_net [get_bd_intf_pins axi_gpio_null/S_AXI] [get_bd_intf_pins interconnect_axilite_user/M00_AXI]
connect_bd_intf_net -intf_net axi_mmu_0_M_AXI [get_bd_intf_pins feature_rom_ctrl/S_AXI] [get_bd_intf_pins feature_rom_mmu/M_AXI]
connect_bd_intf_net -intf_net axi_bram_ctrl_0_BRAM_PORTA [get_bd_intf_pins feature_rom/BRAM_PORTA] [get_bd_intf_pins feature_rom_ctrl/BRAM_PORTA]
connect_bd_intf_net -intf_net aws_0_M_AXI_PCIS_ii [get_bd_intf_pins ii_level0_wire/ULP_M_AXI_DATA_H2C_00] [get_bd_intf_pins interconnect_profile_0/S00_AXI]
connect_bd_intf_net -intf_net aws_0_M_AXI_PCIS_adapter [get_bd_intf_pins axi_clk_metadata_pcis/M_AXI] [get_bd_intf_pins ii_level0_wire/BLP_S_AXI_DATA_H2C_00]
connect_bd_intf_net -intf_net aws_0_M_AXI_PCIS_aws [get_bd_intf_pins aws_0/M_AXI_PCIS] [get_bd_intf_pins axi_clk_metadata_pcis/S_AXI]
connect_bd_intf_net -intf_net aws_0_M_AXI_OCL_ii [get_bd_intf_pins ii_level0_wire/ULP_M_AXI_CTRL_USER_00] [get_bd_intf_pins interconnect_axilite_user/S00_AXI]
connect_bd_intf_net [get_bd_intf_pins feature_rom_mmu/S_AXI] [get_bd_intf_pins interconnect_axilite_user/M01_AXI]
connect_bd_intf_net -intf_net aws_0_M_AXI_OCL_aws [get_bd_intf_pins aws_0/M_AXI_OCL] [get_bd_intf_pins axi_clk_metadata_ocl/S_AXI]
connect_bd_intf_net -intf_net aws_0_M_AXI_OCL_adapter [get_bd_intf_pins axi_clk_metadata_ocl/M_AXI] [get_bd_intf_pins ii_level0_wire/BLP_S_AXI_CTRL_USER_00]
# net aws_0_clk_extra_a1_out has one end: aws_0/clk_extra_a1_out
connect_bd_net -net clk_extra_a1_0_1 [get_bd_ports clk_extra_a1] [get_bd_pins aws_0/clk_extra_a1] [get_bd_pins ii_level0_wire/blp_s_aclk_ctrl_00]
connect_bd_net -net clk_extra_a1_ii [get_bd_pins ii_level0_wire/ulp_m_aclk_ctrl_00] \
  [get_bd_pins axi_gpio_null/s_axi_aclk] [get_bd_pins debug_bridge_0/clk] [get_bd_pins feature_rom_ctrl/s_axi_aclk] \
  [get_bd_pins feature_rom_mmu/aclk] [get_bd_pins interconnect_axilite_user/M00_ACLK] \
  [get_bd_pins interconnect_axilite_user/M01_ACLK] [get_bd_pins reset_controllers/clock_extra_a1_125Mhz]
connect_bd_net -net clk_extra_a2_0_1 [get_bd_ports clk_extra_a2] [get_bd_pins aws_0/clk_extra_a2]
connect_bd_net -net clk_extra_a3_0_1 [get_bd_ports clk_extra_a3] [get_bd_pins aws_0/clk_extra_a3]
connect_bd_net -net clk_extra_b0_0_1 [get_bd_ports clk_extra_b0] [get_bd_pins aws_0/clk_extra_b0] [get_bd_pins ii_level0_wire/blp_s_aclk_kernel_00]
connect_bd_net -net clk_extra_b0_ii [get_bd_pins ii_level0_wire/ulp_m_aclk_kernel_00] [get_bd_pins reset_controllers/clock_extra_b0_250Mhz]
connect_bd_net -net clk_extra_b1_0_1 [get_bd_ports clk_extra_b1] [get_bd_pins aws_0/clk_extra_b1]
connect_bd_net -net clk_extra_c0_0_1 [get_bd_ports clk_extra_c0] [get_bd_pins aws_0/clk_extra_c0] [get_bd_pins ii_level0_wire/blp_s_aclk_extra_c_00]
connect_bd_net -net clk_extra_c0_ii [get_bd_pins ii_level0_wire/ulp_m_aclk_extra_c_00] [get_bd_pins reset_controllers/clock_extra_c0_500Mhz]
connect_bd_net -net clk_extra_c1_0_1 [get_bd_ports clk_extra_c1] [get_bd_pins aws_0/clk_extra_c1]
connect_bd_net [get_bd_pins aws_0/clk_main_a0_out] [get_bd_pins axi_clk_metadata_pcis/s_axi_aclk] [get_bd_pins axi_clk_metadata_ocl/s_axi_aclk]
connect_bd_net -net clk_main_a0_0_1 [get_bd_ports clk_main_a0] \
  [get_bd_pins aws_0/clk_main_a0] [get_bd_pins HIP/s_sh_clk_main_a0] [get_bd_pins axi_clk_metadata_pcis/m_axi_aclk] \
  [get_bd_pins axi_clk_metadata_ocl/m_axi_aclk] [get_bd_pins ii_level0_wire/blp_s_aclk_data_h2c_00]
connect_bd_net -net clk_main_a0_ii [get_bd_pins ii_level0_wire/ulp_m_aclk_data_h2c_00] \
  [get_bd_pins regslice_profile_pipe/aclk] [get_bd_pins downsize_profile/s_axi_aclk] \
  [get_bd_pins interconnect_profile_0/ACLK] [get_bd_pins interconnect_profile_0/S00_ACLK] \
  [get_bd_pins interconnect_profile_0/M01_ACLK] [get_bd_pins interconnect_profile_0/M00_ACLK] \
  [get_bd_pins regslice_profile_null/aclk] [get_bd_pins HIP/aclk] [get_bd_pins interconnect_axilite_user/ACLK] \
  [get_bd_pins interconnect_axilite_user/S00_ACLK] [get_bd_pins reset_controllers/clock_main_a0_250Mhz] \
  [get_bd_pins regslice_h2c_dw512/aclk]
connect_bd_net -net M00_ARESETN_1 [get_bd_pins reset_controllers/clock_extra_a1_125Mhz_interconnect_aresetn] \
  [get_bd_pins axi_gpio_null/s_axi_aresetn] [get_bd_pins feature_rom_ctrl/s_axi_aresetn] \
  [get_bd_pins feature_rom_mmu/aresetn] [get_bd_pins interconnect_axilite_user/M00_ARESETN] \
  [get_bd_pins interconnect_axilite_user/M01_ARESETN]
connect_bd_net -net S_BSCAN_bscanid_en_0_1 [get_bd_ports bscanid_en] [get_bd_pins ii_level0_wire/BLP_S_BSCAN_USER_00_bscanid_en]
connect_bd_net -net S_BSCAN_capture_0_1 [get_bd_ports capture] [get_bd_pins ii_level0_wire/BLP_S_BSCAN_USER_00_capture]
connect_bd_net -net S_BSCAN_drck_0_1 [get_bd_ports drck] [get_bd_pins ii_level0_wire/BLP_S_BSCAN_USER_00_drck]
connect_bd_net -net S_BSCAN_reset_0_1 [get_bd_ports reset] [get_bd_pins ii_level0_wire/BLP_S_BSCAN_USER_00_reset]
connect_bd_net -net S_BSCAN_runtest_0_1 [get_bd_ports runtest] [get_bd_pins ii_level0_wire/BLP_S_BSCAN_USER_00_runtest]
connect_bd_net -net S_BSCAN_sel_0_1 [get_bd_ports sel] [get_bd_pins ii_level0_wire/BLP_S_BSCAN_USER_00_sel]
connect_bd_net -net S_BSCAN_shift_0_1 [get_bd_ports shift] [get_bd_pins ii_level0_wire/BLP_S_BSCAN_USER_00_shift]
connect_bd_net -net S_BSCAN_tck_0_1 [get_bd_ports tck] [get_bd_pins ii_level0_wire/BLP_S_BSCAN_USER_00_tck]
connect_bd_net -net S_BSCAN_tdi_0_1 [get_bd_ports tdi] [get_bd_pins ii_level0_wire/BLP_S_BSCAN_USER_00_tdi]
connect_bd_net -net S_BSCAN_tms_0_1 [get_bd_ports tms] [get_bd_pins ii_level0_wire/BLP_S_BSCAN_USER_00_tms]
connect_bd_net -net S_BSCAN_update_0_1 [get_bd_ports update] [get_bd_pins ii_level0_wire/BLP_S_BSCAN_USER_00_update]
connect_bd_net -net debug_bridge_0_S_BSCAN_tdo [get_bd_pins ii_level0_wire/BLP_S_BSCAN_USER_00_tdo] [get_bd_ports tdo]
connect_bd_net [get_bd_pins aws_0/bar1_sh_arready] [get_bd_ports bar1_sh_arready]
connect_bd_net [get_bd_pins aws_0/bar1_sh_awready] [get_bd_ports bar1_sh_awready]
connect_bd_net [get_bd_pins aws_0/bar1_sh_bresp] [get_bd_ports bar1_sh_bresp]
connect_bd_net [get_bd_pins aws_0/bar1_sh_bvalid] [get_bd_ports bar1_sh_bvalid]
connect_bd_net [get_bd_pins aws_0/bar1_sh_rdata] [get_bd_ports bar1_sh_rdata]
connect_bd_net [get_bd_pins aws_0/bar1_sh_rresp] [get_bd_ports bar1_sh_rresp]
connect_bd_net [get_bd_pins aws_0/bar1_sh_rvalid] [get_bd_ports bar1_sh_rvalid]
connect_bd_net [get_bd_pins aws_0/bar1_sh_wready] [get_bd_ports bar1_sh_wready]
connect_bd_net [get_bd_pins aws_0/cl_sda_arready] [get_bd_ports cl_sda_arready]
connect_bd_net [get_bd_pins aws_0/cl_sda_awready] [get_bd_ports cl_sda_awready]
connect_bd_net [get_bd_pins aws_0/cl_sda_bresp] [get_bd_ports cl_sda_bresp]
connect_bd_net [get_bd_pins aws_0/cl_sda_bvalid] [get_bd_ports cl_sda_bvalid]
connect_bd_net [get_bd_pins aws_0/cl_sda_rdata] [get_bd_ports cl_sda_rdata]
connect_bd_net [get_bd_pins aws_0/cl_sda_rresp] [get_bd_ports cl_sda_rresp]
connect_bd_net [get_bd_pins aws_0/cl_sda_rvalid] [get_bd_ports cl_sda_rvalid]
connect_bd_net [get_bd_pins aws_0/cl_sda_wready] [get_bd_ports cl_sda_wready]
connect_bd_net [get_bd_pins aws_0/cl_sh_apppf_irq_req] [get_bd_ports cl_sh_apppf_irq_req]
connect_bd_net [get_bd_pins aws_0/cl_sh_dma_pcis_arready] [get_bd_ports cl_sh_dma_pcis_arready]
connect_bd_net [get_bd_pins aws_0/cl_sh_dma_pcis_awready] [get_bd_ports cl_sh_dma_pcis_awready]
connect_bd_net [get_bd_pins aws_0/cl_sh_dma_pcis_bid] [get_bd_ports cl_sh_dma_pcis_bid]
connect_bd_net [get_bd_pins aws_0/cl_sh_dma_pcis_bresp] [get_bd_ports cl_sh_dma_pcis_bresp]
connect_bd_net [get_bd_pins aws_0/cl_sh_dma_pcis_bvalid] [get_bd_ports cl_sh_dma_pcis_bvalid]
connect_bd_net [get_bd_pins aws_0/cl_sh_dma_pcis_rdata] [get_bd_ports cl_sh_dma_pcis_rdata]
connect_bd_net [get_bd_pins aws_0/cl_sh_dma_pcis_rid] [get_bd_ports cl_sh_dma_pcis_rid]
connect_bd_net [get_bd_pins aws_0/cl_sh_dma_pcis_rlast] [get_bd_ports cl_sh_dma_pcis_rlast]
connect_bd_net [get_bd_pins aws_0/cl_sh_dma_pcis_rresp] [get_bd_ports cl_sh_dma_pcis_rresp]
connect_bd_net [get_bd_pins aws_0/cl_sh_dma_pcis_rvalid] [get_bd_ports cl_sh_dma_pcis_rvalid]
connect_bd_net [get_bd_pins aws_0/cl_sh_dma_pcis_wready] [get_bd_ports cl_sh_dma_pcis_wready]
connect_bd_net [get_bd_pins aws_0/cl_sh_dma_rd_full] [get_bd_ports cl_sh_dma_rd_full]
connect_bd_net [get_bd_pins aws_0/cl_sh_dma_wr_full] [get_bd_ports cl_sh_dma_wr_full]
connect_bd_net [get_bd_pins aws_0/cl_sh_flr_done] [get_bd_ports cl_sh_flr_done]
connect_bd_net [get_bd_pins aws_0/cl_sh_id0] [get_bd_ports cl_sh_id0]
connect_bd_net [get_bd_pins aws_0/cl_sh_id1] [get_bd_ports cl_sh_id1]
connect_bd_net [get_bd_pins aws_0/cl_sh_pcim_araddr] [get_bd_ports cl_sh_pcim_araddr]
connect_bd_net [get_bd_pins aws_0/cl_sh_pcim_arid] [get_bd_ports cl_sh_pcim_arid]
connect_bd_net [get_bd_pins aws_0/cl_sh_pcim_arlen] [get_bd_ports cl_sh_pcim_arlen]
connect_bd_net [get_bd_pins aws_0/cl_sh_pcim_arsize] [get_bd_ports cl_sh_pcim_arsize]
connect_bd_net [get_bd_pins aws_0/cl_sh_pcim_aruser] [get_bd_ports cl_sh_pcim_aruser]
connect_bd_net [get_bd_pins aws_0/cl_sh_pcim_arvalid] [get_bd_ports cl_sh_pcim_arvalid]
connect_bd_net [get_bd_pins aws_0/cl_sh_pcim_awaddr] [get_bd_ports cl_sh_pcim_awaddr]
connect_bd_net [get_bd_pins aws_0/cl_sh_pcim_awid] [get_bd_ports cl_sh_pcim_awid]
connect_bd_net [get_bd_pins aws_0/cl_sh_pcim_awlen] [get_bd_ports cl_sh_pcim_awlen]
connect_bd_net [get_bd_pins aws_0/cl_sh_pcim_awsize] [get_bd_ports cl_sh_pcim_awsize]
connect_bd_net [get_bd_pins aws_0/cl_sh_pcim_awuser] [get_bd_ports cl_sh_pcim_awuser]
connect_bd_net [get_bd_pins aws_0/cl_sh_pcim_awvalid] [get_bd_ports cl_sh_pcim_awvalid]
connect_bd_net [get_bd_pins aws_0/cl_sh_pcim_bready] [get_bd_ports cl_sh_pcim_bready]
connect_bd_net [get_bd_pins aws_0/cl_sh_pcim_rready] [get_bd_ports cl_sh_pcim_rready]
connect_bd_net [get_bd_pins aws_0/cl_sh_pcim_wdata] [get_bd_ports cl_sh_pcim_wdata]
connect_bd_net [get_bd_pins aws_0/cl_sh_pcim_wlast] [get_bd_ports cl_sh_pcim_wlast]
connect_bd_net [get_bd_pins aws_0/cl_sh_pcim_wstrb] [get_bd_ports cl_sh_pcim_wstrb]
connect_bd_net [get_bd_pins aws_0/cl_sh_pcim_wvalid] [get_bd_ports cl_sh_pcim_wvalid]
connect_bd_net [get_bd_pins aws_0/cl_sh_status0] [get_bd_ports cl_sh_status0]
connect_bd_net [get_bd_pins aws_0/cl_sh_status1] [get_bd_ports cl_sh_status1]
connect_bd_net [get_bd_pins aws_0/cl_sh_status_vled] [get_bd_ports cl_sh_status_vled]
connect_bd_net [get_bd_pins aws_0/ocl_sh_arready] [get_bd_ports ocl_sh_arready]
connect_bd_net [get_bd_pins aws_0/ocl_sh_awready] [get_bd_ports ocl_sh_awready]
connect_bd_net [get_bd_pins aws_0/ocl_sh_bresp] [get_bd_ports ocl_sh_bresp]
connect_bd_net [get_bd_pins aws_0/ocl_sh_bvalid] [get_bd_ports ocl_sh_bvalid]
connect_bd_net [get_bd_pins aws_0/ocl_sh_rdata] [get_bd_ports ocl_sh_rdata]
connect_bd_net [get_bd_pins aws_0/ocl_sh_rresp] [get_bd_ports ocl_sh_rresp]
connect_bd_net [get_bd_pins aws_0/ocl_sh_rvalid] [get_bd_ports ocl_sh_rvalid]
connect_bd_net [get_bd_pins aws_0/ocl_sh_wready] [get_bd_ports ocl_sh_wready]
connect_bd_net [get_bd_pins aws_0/status_vdip] [get_bd_pins reset_controllers/status_vdip]
connect_bd_net -net cfg_max_payload_0_1 [get_bd_ports cfg_max_payload] [get_bd_pins aws_0/cfg_max_payload]
connect_bd_net -net cfg_max_read_req_0_1 [get_bd_ports cfg_max_read_req] [get_bd_pins aws_0/cfg_max_read_req]
connect_bd_net [get_bd_pins aws_0/kernel_rst_n_out] [get_bd_pins reset_controllers/kernel_reset_n_out]
connect_bd_net -net kernel_rst_n_0_1 [get_bd_ports kernel_rst_n] [get_bd_pins aws_0/kernel_rst_n]
connect_bd_net -net rst_main_n_0_1 [get_bd_ports rst_main_n] \
  [get_bd_pins aws_0/rst_main_n] [get_bd_pins HIP/s_sh_rst_main_n] [get_bd_pins ii_level0_wire/blp_s_aresetn_data_h2c_00]
connect_bd_net -net rst_main_n_ii [get_bd_pins ii_level0_wire/ulp_m_aresetn_data_h2c_00] [get_bd_pins reset_controllers/ext_reset_in]
connect_bd_net -net ARESETN_1 [get_bd_pins reset_controllers/clock_main_a0_250Mhz_interconnect_aresetn] \
  [get_bd_pins interconnect_profile_0/ARESETN] [get_bd_pins interconnect_profile_0/S00_ARESETN] \
  [get_bd_pins interconnect_profile_0/M01_ARESETN] [get_bd_pins interconnect_profile_0/M00_ARESETN] \
  [get_bd_pins regslice_profile_null/aresetn] [get_bd_pins regslice_profile_pipe/aresetn] \
  [get_bd_pins downsize_profile/s_axi_aresetn] [get_bd_pins HIP/aresetn] [get_bd_pins interconnect_axilite_user/ARESETN] \
  [get_bd_pins interconnect_axilite_user/S00_ARESETN] [get_bd_pins regslice_h2c_dw512/aresetn]
connect_bd_net -net sda_cl_araddr_0_1 [get_bd_ports sda_cl_araddr] [get_bd_pins aws_0/sda_cl_araddr]
connect_bd_net -net sda_cl_arvalid_0_1 [get_bd_ports sda_cl_arvalid] [get_bd_pins aws_0/sda_cl_arvalid]
connect_bd_net -net sda_cl_awaddr_0_1 [get_bd_ports sda_cl_awaddr] [get_bd_pins aws_0/sda_cl_awaddr]
connect_bd_net -net sda_cl_awvalid_0_1 [get_bd_ports sda_cl_awvalid] [get_bd_pins aws_0/sda_cl_awvalid]
connect_bd_net -net sda_cl_bready_0_1 [get_bd_ports sda_cl_bready] [get_bd_pins aws_0/sda_cl_bready]
connect_bd_net -net sda_cl_rready_0_1 [get_bd_ports sda_cl_rready] [get_bd_pins aws_0/sda_cl_rready]
connect_bd_net -net sda_cl_wdata_0_1 [get_bd_ports sda_cl_wdata] [get_bd_pins aws_0/sda_cl_wdata]
connect_bd_net -net sda_cl_wstrb_0_1 [get_bd_ports sda_cl_wstrb] [get_bd_pins aws_0/sda_cl_wstrb]
connect_bd_net -net sda_cl_wvalid_0_1 [get_bd_ports sda_cl_wvalid] [get_bd_pins aws_0/sda_cl_wvalid]
connect_bd_net -net sh_bar1_araddr_0_1 [get_bd_ports sh_bar1_araddr] [get_bd_pins aws_0/sh_bar1_araddr]
connect_bd_net -net sh_bar1_arvalid_0_1 [get_bd_ports sh_bar1_arvalid] [get_bd_pins aws_0/sh_bar1_arvalid]
connect_bd_net -net sh_bar1_awaddr_0_1 [get_bd_ports sh_bar1_awaddr] [get_bd_pins aws_0/sh_bar1_awaddr]
connect_bd_net -net sh_bar1_awvalid_0_1 [get_bd_ports sh_bar1_awvalid] [get_bd_pins aws_0/sh_bar1_awvalid]
connect_bd_net -net sh_bar1_bready_0_1 [get_bd_ports sh_bar1_bready] [get_bd_pins aws_0/sh_bar1_bready]
connect_bd_net -net sh_bar1_rready_0_1 [get_bd_ports sh_bar1_rready] [get_bd_pins aws_0/sh_bar1_rready]
connect_bd_net -net sh_bar1_wdata_0_1 [get_bd_ports sh_bar1_wdata] [get_bd_pins aws_0/sh_bar1_wdata]
connect_bd_net -net sh_bar1_wstrb_0_1 [get_bd_ports sh_bar1_wstrb] [get_bd_pins aws_0/sh_bar1_wstrb]
connect_bd_net -net sh_bar1_wvalid_0_1 [get_bd_ports sh_bar1_wvalid] [get_bd_pins aws_0/sh_bar1_wvalid]
connect_bd_net -net sh_cl_apppf_irq_ack_0_1 [get_bd_ports sh_cl_apppf_irq_ack] [get_bd_pins aws_0/sh_cl_apppf_irq_ack]
connect_bd_net -net sh_cl_ctl0_0_1 [get_bd_ports sh_cl_ctl0] [get_bd_pins aws_0/sh_cl_ctl0]
connect_bd_net -net sh_cl_ctl1_0_1 [get_bd_ports sh_cl_ctl1] [get_bd_pins aws_0/sh_cl_ctl1]
connect_bd_net -net sh_cl_dma_pcis_araddr_0_1 [get_bd_ports sh_cl_dma_pcis_araddr] [get_bd_pins aws_0/sh_cl_dma_pcis_araddr]
connect_bd_net -net sh_cl_dma_pcis_arid_0_1 [get_bd_ports sh_cl_dma_pcis_arid] [get_bd_pins aws_0/sh_cl_dma_pcis_arid]
connect_bd_net -net sh_cl_dma_pcis_arlen_0_1 [get_bd_ports sh_cl_dma_pcis_arlen] [get_bd_pins aws_0/sh_cl_dma_pcis_arlen]
connect_bd_net -net sh_cl_dma_pcis_arsize_0_1 [get_bd_ports sh_cl_dma_pcis_arsize] [get_bd_pins aws_0/sh_cl_dma_pcis_arsize]
connect_bd_net -net sh_cl_dma_pcis_arvalid_0_1 [get_bd_ports sh_cl_dma_pcis_arvalid] [get_bd_pins aws_0/sh_cl_dma_pcis_arvalid]
connect_bd_net -net sh_cl_dma_pcis_awaddr_0_1 [get_bd_ports sh_cl_dma_pcis_awaddr] [get_bd_pins aws_0/sh_cl_dma_pcis_awaddr]
connect_bd_net -net sh_cl_dma_pcis_awid_0_1 [get_bd_ports sh_cl_dma_pcis_awid] [get_bd_pins aws_0/sh_cl_dma_pcis_awid]
connect_bd_net -net sh_cl_dma_pcis_awlen_0_1 [get_bd_ports sh_cl_dma_pcis_awlen] [get_bd_pins aws_0/sh_cl_dma_pcis_awlen]
connect_bd_net -net sh_cl_dma_pcis_awsize_0_1 [get_bd_ports sh_cl_dma_pcis_awsize] [get_bd_pins aws_0/sh_cl_dma_pcis_awsize]
connect_bd_net -net sh_cl_dma_pcis_awvalid_0_1 [get_bd_ports sh_cl_dma_pcis_awvalid] [get_bd_pins aws_0/sh_cl_dma_pcis_awvalid]
connect_bd_net -net sh_cl_dma_pcis_bready_0_1 [get_bd_ports sh_cl_dma_pcis_bready] [get_bd_pins aws_0/sh_cl_dma_pcis_bready]
connect_bd_net -net sh_cl_dma_pcis_rready_0_1 [get_bd_ports sh_cl_dma_pcis_rready] [get_bd_pins aws_0/sh_cl_dma_pcis_rready]
connect_bd_net -net sh_cl_dma_pcis_wdata_0_1 [get_bd_ports sh_cl_dma_pcis_wdata] [get_bd_pins aws_0/sh_cl_dma_pcis_wdata]
connect_bd_net -net sh_cl_dma_pcis_wlast_0_1 [get_bd_ports sh_cl_dma_pcis_wlast] [get_bd_pins aws_0/sh_cl_dma_pcis_wlast]
connect_bd_net -net sh_cl_dma_pcis_wstrb_0_1 [get_bd_ports sh_cl_dma_pcis_wstrb] [get_bd_pins aws_0/sh_cl_dma_pcis_wstrb]
connect_bd_net -net sh_cl_dma_pcis_wvalid_0_1 [get_bd_ports sh_cl_dma_pcis_wvalid] [get_bd_pins aws_0/sh_cl_dma_pcis_wvalid]
connect_bd_net -net sh_cl_flr_assert_0_1 [get_bd_ports sh_cl_flr_assert] [get_bd_pins aws_0/sh_cl_flr_assert]
connect_bd_net -net sh_cl_glcount0_0_1 [get_bd_ports sh_cl_glcount0] [get_bd_pins aws_0/sh_cl_glcount0]
connect_bd_net -net sh_cl_glcount1_0_1 [get_bd_ports sh_cl_glcount1] [get_bd_pins aws_0/sh_cl_glcount1]
connect_bd_net -net sh_cl_pcim_arready_0_1 [get_bd_ports sh_cl_pcim_arready] [get_bd_pins aws_0/sh_cl_pcim_arready]
connect_bd_net -net sh_cl_pcim_awready_0_1 [get_bd_ports sh_cl_pcim_awready] [get_bd_pins aws_0/sh_cl_pcim_awready]
connect_bd_net -net sh_cl_pcim_bid_0_1 [get_bd_ports sh_cl_pcim_bid] [get_bd_pins aws_0/sh_cl_pcim_bid]
connect_bd_net -net sh_cl_pcim_bresp_0_1 [get_bd_ports sh_cl_pcim_bresp] [get_bd_pins aws_0/sh_cl_pcim_bresp]
connect_bd_net -net sh_cl_pcim_bvalid_0_1 [get_bd_ports sh_cl_pcim_bvalid] [get_bd_pins aws_0/sh_cl_pcim_bvalid]
connect_bd_net -net sh_cl_pcim_rdata_0_1 [get_bd_ports sh_cl_pcim_rdata] [get_bd_pins aws_0/sh_cl_pcim_rdata]
connect_bd_net -net sh_cl_pcim_rid_0_1 [get_bd_ports sh_cl_pcim_rid] [get_bd_pins aws_0/sh_cl_pcim_rid]
connect_bd_net -net sh_cl_pcim_rlast_0_1 [get_bd_ports sh_cl_pcim_rlast] [get_bd_pins aws_0/sh_cl_pcim_rlast]
connect_bd_net -net sh_cl_pcim_rresp_0_1 [get_bd_ports sh_cl_pcim_rresp] [get_bd_pins aws_0/sh_cl_pcim_rresp]
connect_bd_net -net sh_cl_pcim_rvalid_0_1 [get_bd_ports sh_cl_pcim_rvalid] [get_bd_pins aws_0/sh_cl_pcim_rvalid]
connect_bd_net -net sh_cl_pcim_wready_0_1 [get_bd_ports sh_cl_pcim_wready] [get_bd_pins aws_0/sh_cl_pcim_wready]
connect_bd_net -net sh_cl_pwr_state_0_1 [get_bd_ports sh_cl_pwr_state] [get_bd_pins aws_0/sh_cl_pwr_state]
connect_bd_net -net sh_cl_status_vdip_0_1 [get_bd_ports sh_cl_status_vdip] [get_bd_pins aws_0/sh_cl_status_vdip]
connect_bd_net -net sh_ocl_araddr_0_1 [get_bd_ports sh_ocl_araddr] [get_bd_pins aws_0/sh_ocl_araddr]
connect_bd_net -net sh_ocl_arvalid_0_1 [get_bd_ports sh_ocl_arvalid] [get_bd_pins aws_0/sh_ocl_arvalid]
connect_bd_net -net sh_ocl_awaddr_0_1 [get_bd_ports sh_ocl_awaddr] [get_bd_pins aws_0/sh_ocl_awaddr]
connect_bd_net -net sh_ocl_awvalid_0_1 [get_bd_ports sh_ocl_awvalid] [get_bd_pins aws_0/sh_ocl_awvalid]
connect_bd_net -net sh_ocl_bready_0_1 [get_bd_ports sh_ocl_bready] [get_bd_pins aws_0/sh_ocl_bready]
connect_bd_net -net sh_ocl_rready_0_1 [get_bd_ports sh_ocl_rready] [get_bd_pins aws_0/sh_ocl_rready]
connect_bd_net -net sh_ocl_wdata_0_1 [get_bd_ports sh_ocl_wdata] [get_bd_pins aws_0/sh_ocl_wdata]
connect_bd_net -net sh_ocl_wstrb_0_1 [get_bd_ports sh_ocl_wstrb] [get_bd_pins aws_0/sh_ocl_wstrb]
connect_bd_net -net sh_ocl_wvalid_0_1 [get_bd_ports sh_ocl_wvalid] [get_bd_pins aws_0/sh_ocl_wvalid]
connect_bd_net -net CLK_300M_DIMM0_DN_0_1 [get_bd_ports CLK_300M_DIMM0_DN] [get_bd_pins HIP/s_sh_clk_300m_dimm0_dn]
connect_bd_net -net CLK_300M_DIMM0_DP_0_1 [get_bd_ports CLK_300M_DIMM0_DP] [get_bd_pins HIP/s_sh_clk_300m_dimm0_dp]
connect_bd_net -net CLK_300M_DIMM1_DN_0_1 [get_bd_ports CLK_300M_DIMM1_DN] [get_bd_pins HIP/s_sh_clk_300m_dimm1_dn]
connect_bd_net -net CLK_300M_DIMM1_DP_0_1 [get_bd_ports CLK_300M_DIMM1_DP] [get_bd_pins HIP/s_sh_clk_300m_dimm1_dp]
connect_bd_net -net CLK_300M_DIMM3_DN_0_1 [get_bd_ports CLK_300M_DIMM3_DN] [get_bd_pins HIP/s_sh_clk_300m_dimm3_dn]
connect_bd_net -net CLK_300M_DIMM3_DP_0_1 [get_bd_ports CLK_300M_DIMM3_DP] [get_bd_pins HIP/s_sh_clk_300m_dimm3_dp]
connect_bd_net -net HIP_M_A_ACT_N [get_bd_pins HIP/s_sh_m_a_act_n] [get_bd_ports M_A_ACT_N]
connect_bd_net -net HIP_M_A_BA [get_bd_pins HIP/s_sh_m_a_ba] [get_bd_ports M_A_BA]
connect_bd_net -net HIP_M_A_BG [get_bd_pins HIP/s_sh_m_a_bg] [get_bd_ports M_A_BG]
connect_bd_net -net HIP_M_A_CKE [get_bd_pins HIP/s_sh_m_a_cke] [get_bd_ports M_A_CKE]
connect_bd_net -net HIP_M_A_CLK_DN [get_bd_pins HIP/s_sh_m_a_clk_dn] [get_bd_ports M_A_CLK_DN]
connect_bd_net -net HIP_M_A_CLK_DP [get_bd_pins HIP/s_sh_m_a_clk_dp] [get_bd_ports M_A_CLK_DP]
connect_bd_net -net HIP_M_A_CS_N [get_bd_pins HIP/s_sh_m_a_cs_n] [get_bd_ports M_A_CS_N]
connect_bd_net -net HIP_M_A_MA [get_bd_pins HIP/s_sh_m_a_ma] [get_bd_ports M_A_MA]
connect_bd_net -net HIP_M_A_ODT [get_bd_pins HIP/s_sh_m_a_odt] [get_bd_ports M_A_ODT]
connect_bd_net -net HIP_M_A_PAR [get_bd_pins HIP/s_sh_m_a_par] [get_bd_ports M_A_PAR]
connect_bd_net -net HIP_M_B_ACT_N [get_bd_pins HIP/s_sh_m_b_act_n] [get_bd_ports M_B_ACT_N]
connect_bd_net -net HIP_M_B_BA [get_bd_pins HIP/s_sh_m_b_ba] [get_bd_ports M_B_BA]
connect_bd_net -net HIP_M_B_BG [get_bd_pins HIP/s_sh_m_b_bg] [get_bd_ports M_B_BG]
connect_bd_net -net HIP_M_B_CKE [get_bd_pins HIP/s_sh_m_b_cke] [get_bd_ports M_B_CKE]
connect_bd_net -net HIP_M_B_CLK_DN [get_bd_pins HIP/s_sh_m_b_clk_dn] [get_bd_ports M_B_CLK_DN]
connect_bd_net -net HIP_M_B_CLK_DP [get_bd_pins HIP/s_sh_m_b_clk_dp] [get_bd_ports M_B_CLK_DP]
connect_bd_net -net HIP_M_B_CS_N [get_bd_pins HIP/s_sh_m_b_cs_n] [get_bd_ports M_B_CS_N]
connect_bd_net -net HIP_M_B_MA [get_bd_pins HIP/s_sh_m_b_ma] [get_bd_ports M_B_MA]
connect_bd_net -net HIP_M_B_ODT [get_bd_pins HIP/s_sh_m_b_odt] [get_bd_ports M_B_ODT]
connect_bd_net -net HIP_M_B_PAR [get_bd_pins HIP/s_sh_m_b_par] [get_bd_ports M_B_PAR]
connect_bd_net -net HIP_M_D_ACT_N [get_bd_pins HIP/s_sh_m_d_act_n] [get_bd_ports M_D_ACT_N]
connect_bd_net -net HIP_M_D_BA [get_bd_pins HIP/s_sh_m_d_ba] [get_bd_ports M_D_BA]
connect_bd_net -net HIP_M_D_BG [get_bd_pins HIP/s_sh_m_d_bg] [get_bd_ports M_D_BG]
connect_bd_net -net HIP_M_D_CKE [get_bd_pins HIP/s_sh_m_d_cke] [get_bd_ports M_D_CKE]
connect_bd_net -net HIP_M_D_CLK_DN [get_bd_pins HIP/s_sh_m_d_clk_dn] [get_bd_ports M_D_CLK_DN]
connect_bd_net -net HIP_M_D_CLK_DP [get_bd_pins HIP/s_sh_m_d_clk_dp] [get_bd_ports M_D_CLK_DP]
connect_bd_net -net HIP_M_D_CS_N [get_bd_pins HIP/s_sh_m_d_cs_n] [get_bd_ports M_D_CS_N]
connect_bd_net -net HIP_M_D_MA [get_bd_pins HIP/s_sh_m_d_ma] [get_bd_ports M_D_MA]
connect_bd_net -net HIP_M_D_ODT [get_bd_pins HIP/s_sh_m_d_odt] [get_bd_ports M_D_ODT]
connect_bd_net -net HIP_M_D_PAR [get_bd_pins HIP/s_sh_m_d_par] [get_bd_ports M_D_PAR]
connect_bd_net -net HIP_cl_RST_DIMM_A_N [get_bd_pins HIP/s_sh_cl_rst_dimm_a_n] [get_bd_ports cl_RST_DIMM_A_N]
connect_bd_net -net HIP_cl_RST_DIMM_B_N [get_bd_pins HIP/s_sh_cl_rst_dimm_b_n] [get_bd_ports cl_RST_DIMM_B_N]
connect_bd_net -net HIP_cl_RST_DIMM_D_N [get_bd_pins HIP/s_sh_cl_rst_dimm_d_n] [get_bd_ports cl_RST_DIMM_D_N]
connect_bd_net -net HIP_cl_sh_ddr_araddr [get_bd_pins HIP/s_sh_cl_sh_ddr_araddr] [get_bd_ports cl_sh_ddr_araddr]
connect_bd_net -net HIP_cl_sh_ddr_arburst [get_bd_pins HIP/s_sh_cl_sh_ddr_arburst] [get_bd_ports cl_sh_ddr_arburst]
connect_bd_net -net HIP_cl_sh_ddr_arid [get_bd_pins HIP/s_sh_cl_sh_ddr_arid] [get_bd_ports cl_sh_ddr_arid]
connect_bd_net -net HIP_cl_sh_ddr_arlen [get_bd_pins HIP/s_sh_cl_sh_ddr_arlen] [get_bd_ports cl_sh_ddr_arlen]
connect_bd_net -net HIP_cl_sh_ddr_arsize [get_bd_pins HIP/s_sh_cl_sh_ddr_arsize] [get_bd_ports cl_sh_ddr_arsize]
connect_bd_net -net HIP_cl_sh_ddr_arvalid [get_bd_pins HIP/s_sh_cl_sh_ddr_arvalid] [get_bd_ports cl_sh_ddr_arvalid]
connect_bd_net -net HIP_cl_sh_ddr_awaddr [get_bd_pins HIP/s_sh_cl_sh_ddr_awaddr] [get_bd_ports cl_sh_ddr_awaddr]
connect_bd_net -net HIP_cl_sh_ddr_awburst [get_bd_pins HIP/s_sh_cl_sh_ddr_awburst] [get_bd_ports cl_sh_ddr_awburst]
connect_bd_net -net HIP_cl_sh_ddr_awid [get_bd_pins HIP/s_sh_cl_sh_ddr_awid] [get_bd_ports cl_sh_ddr_awid]
connect_bd_net -net HIP_cl_sh_ddr_awlen [get_bd_pins HIP/s_sh_cl_sh_ddr_awlen] [get_bd_ports cl_sh_ddr_awlen]
connect_bd_net -net HIP_cl_sh_ddr_awsize [get_bd_pins HIP/s_sh_cl_sh_ddr_awsize] [get_bd_ports cl_sh_ddr_awsize]
connect_bd_net -net HIP_cl_sh_ddr_awvalid [get_bd_pins HIP/s_sh_cl_sh_ddr_awvalid] [get_bd_ports cl_sh_ddr_awvalid]
connect_bd_net -net HIP_cl_sh_ddr_bready [get_bd_pins HIP/s_sh_cl_sh_ddr_bready] [get_bd_ports cl_sh_ddr_bready]
connect_bd_net -net HIP_cl_sh_ddr_rready [get_bd_pins HIP/s_sh_cl_sh_ddr_rready] [get_bd_ports cl_sh_ddr_rready]
connect_bd_net -net HIP_cl_sh_ddr_wdata [get_bd_pins HIP/s_sh_cl_sh_ddr_wdata] [get_bd_ports cl_sh_ddr_wdata]
connect_bd_net -net HIP_cl_sh_ddr_wid [get_bd_pins HIP/s_sh_cl_sh_ddr_wid] [get_bd_ports cl_sh_ddr_wid]
connect_bd_net -net HIP_cl_sh_ddr_wlast [get_bd_pins HIP/s_sh_cl_sh_ddr_wlast] [get_bd_ports cl_sh_ddr_wlast]
connect_bd_net -net HIP_cl_sh_ddr_wstrb [get_bd_pins HIP/s_sh_cl_sh_ddr_wstrb] [get_bd_ports cl_sh_ddr_wstrb]
connect_bd_net -net HIP_cl_sh_ddr_wvalid [get_bd_pins HIP/s_sh_cl_sh_ddr_wvalid] [get_bd_ports cl_sh_ddr_wvalid]
connect_bd_net -net sh_cl_ddr_arready_0_1 [get_bd_ports sh_cl_ddr_arready] [get_bd_pins HIP/s_sh_sh_cl_ddr_arready]
connect_bd_net -net sh_cl_ddr_awready_0_1 [get_bd_ports sh_cl_ddr_awready] [get_bd_pins HIP/s_sh_sh_cl_ddr_awready]
connect_bd_net -net sh_cl_ddr_bid_0_1 [get_bd_ports sh_cl_ddr_bid] [get_bd_pins HIP/s_sh_sh_cl_ddr_bid]
connect_bd_net -net sh_cl_ddr_bresp_0_1 [get_bd_ports sh_cl_ddr_bresp] [get_bd_pins HIP/s_sh_sh_cl_ddr_bresp]
connect_bd_net -net sh_cl_ddr_bvalid_0_1 [get_bd_ports sh_cl_ddr_bvalid] [get_bd_pins HIP/s_sh_sh_cl_ddr_bvalid]
connect_bd_net -net sh_cl_ddr_is_ready_0_1 [get_bd_ports sh_cl_ddr_is_ready] [get_bd_pins HIP/s_sh_sh_cl_ddr_is_ready]
connect_bd_net -net sh_cl_ddr_rdata_0_1 [get_bd_ports sh_cl_ddr_rdata] [get_bd_pins HIP/s_sh_sh_cl_ddr_rdata]
connect_bd_net -net sh_cl_ddr_rid_0_1 [get_bd_ports sh_cl_ddr_rid] [get_bd_pins HIP/s_sh_sh_cl_ddr_rid]
connect_bd_net -net sh_cl_ddr_rlast_0_1 [get_bd_ports sh_cl_ddr_rlast] [get_bd_pins HIP/s_sh_sh_cl_ddr_rlast]
connect_bd_net -net sh_cl_ddr_rresp_0_1 [get_bd_ports sh_cl_ddr_rresp] [get_bd_pins HIP/s_sh_sh_cl_ddr_rresp]
connect_bd_net -net sh_cl_ddr_rvalid_0_1 [get_bd_ports sh_cl_ddr_rvalid] [get_bd_pins HIP/s_sh_sh_cl_ddr_rvalid]
connect_bd_net -net sh_cl_ddr_wready_0_1 [get_bd_ports sh_cl_ddr_wready] [get_bd_pins HIP/s_sh_sh_cl_ddr_wready]
connect_bd_net -net HIP_ddr_sh_stat_ack0 [get_bd_pins HIP/s_sh_ddr_sh_stat_ack0] [get_bd_ports ddr_sh_stat_ack0]
connect_bd_net -net HIP_ddr_sh_stat_ack1 [get_bd_pins HIP/s_sh_ddr_sh_stat_ack1] [get_bd_ports ddr_sh_stat_ack1]
connect_bd_net -net HIP_ddr_sh_stat_ack2 [get_bd_pins HIP/s_sh_ddr_sh_stat_ack2] [get_bd_ports ddr_sh_stat_ack2]
connect_bd_net -net HIP_ddr_sh_stat_int0 [get_bd_pins HIP/s_sh_ddr_sh_stat_int0] [get_bd_ports ddr_sh_stat_int0]
connect_bd_net -net HIP_ddr_sh_stat_int1 [get_bd_pins HIP/s_sh_ddr_sh_stat_int1] [get_bd_ports ddr_sh_stat_int1]
connect_bd_net -net HIP_ddr_sh_stat_int2 [get_bd_pins HIP/s_sh_ddr_sh_stat_int2] [get_bd_ports ddr_sh_stat_int2]
connect_bd_net -net HIP_ddr_sh_stat_rdata0 [get_bd_pins HIP/s_sh_ddr_sh_stat_rdata0] [get_bd_ports ddr_sh_stat_rdata0]
connect_bd_net -net HIP_ddr_sh_stat_rdata1 [get_bd_pins HIP/s_sh_ddr_sh_stat_rdata1] [get_bd_ports ddr_sh_stat_rdata1]
connect_bd_net -net HIP_ddr_sh_stat_rdata2 [get_bd_pins HIP/s_sh_ddr_sh_stat_rdata2] [get_bd_ports ddr_sh_stat_rdata2]
connect_bd_net -net sh_ddr_stat_addr0_0_1 [get_bd_ports sh_ddr_stat_addr0] [get_bd_pins HIP/s_sh_sh_ddr_stat_addr0]
connect_bd_net -net sh_ddr_stat_addr1_0_1 [get_bd_ports sh_ddr_stat_addr1] [get_bd_pins HIP/s_sh_sh_ddr_stat_addr1]
connect_bd_net -net sh_ddr_stat_addr2_0_1 [get_bd_ports sh_ddr_stat_addr2] [get_bd_pins HIP/s_sh_sh_ddr_stat_addr2]
connect_bd_net -net sh_ddr_stat_rd0_0_1 [get_bd_ports sh_ddr_stat_rd0] [get_bd_pins HIP/s_sh_sh_ddr_stat_rd0]
connect_bd_net -net sh_ddr_stat_rd1_0_1 [get_bd_ports sh_ddr_stat_rd1] [get_bd_pins HIP/s_sh_sh_ddr_stat_rd1]
connect_bd_net -net sh_ddr_stat_rd2_0_1 [get_bd_ports sh_ddr_stat_rd2] [get_bd_pins HIP/s_sh_sh_ddr_stat_rd2]
connect_bd_net -net sh_ddr_stat_wdata0_0_1 [get_bd_ports sh_ddr_stat_wdata0] [get_bd_pins HIP/s_sh_sh_ddr_stat_wdata0]
connect_bd_net -net sh_ddr_stat_wdata1_0_1 [get_bd_ports sh_ddr_stat_wdata1] [get_bd_pins HIP/s_sh_sh_ddr_stat_wdata1]
connect_bd_net -net sh_ddr_stat_wdata2_0_1 [get_bd_ports sh_ddr_stat_wdata2] [get_bd_pins HIP/s_sh_sh_ddr_stat_wdata2]
connect_bd_net -net sh_ddr_stat_wr0_0_1 [get_bd_ports sh_ddr_stat_wr0] [get_bd_pins HIP/s_sh_sh_ddr_stat_wr0]
connect_bd_net -net sh_ddr_stat_wr1_0_1 [get_bd_ports sh_ddr_stat_wr1] [get_bd_pins HIP/s_sh_sh_ddr_stat_wr1]
connect_bd_net -net sh_ddr_stat_wr2_0_1 [get_bd_ports sh_ddr_stat_wr2] [get_bd_pins HIP/s_sh_sh_ddr_stat_wr2]
connect_bd_net [get_bd_ports M_A_ECC] [get_bd_pins HIP/s_sh_m_a_ecc]
connect_bd_net [get_bd_ports M_A_DQS_DN] [get_bd_pins HIP/s_sh_m_a_dqs_dn]
connect_bd_net [get_bd_ports M_B_ECC] [get_bd_pins HIP/s_sh_m_b_ecc]
connect_bd_net [get_bd_ports M_B_DQS_DN] [get_bd_pins HIP/s_sh_m_b_dqs_dn]
connect_bd_net [get_bd_ports M_D_ECC] [get_bd_pins HIP/s_sh_m_d_ecc]
connect_bd_net [get_bd_ports M_A_DQ] [get_bd_pins HIP/s_sh_m_a_dq]
connect_bd_net [get_bd_ports M_A_DQS_DP] [get_bd_pins HIP/s_sh_m_a_dqs_dp]
connect_bd_net [get_bd_ports M_B_DQ] [get_bd_pins HIP/s_sh_m_b_dq]
connect_bd_net [get_bd_ports M_B_DQS_DP] [get_bd_pins HIP/s_sh_m_b_dqs_dp]
connect_bd_net [get_bd_ports M_D_DQ] [get_bd_pins HIP/s_sh_m_d_dq]
connect_bd_net [get_bd_ports M_D_DQS_DP] [get_bd_pins HIP/s_sh_m_d_dqs_dp]
connect_bd_net [get_bd_ports M_D_DQS_DN] [get_bd_pins HIP/s_sh_m_d_dqs_dn]
set_property HDL_ATTRIBUTE.DPA_AXILITE_MASTER primary [get_bd_cells interconnect_axilite_user]
